# Altium project QUTMS-SHDN-V00.PrjPcb
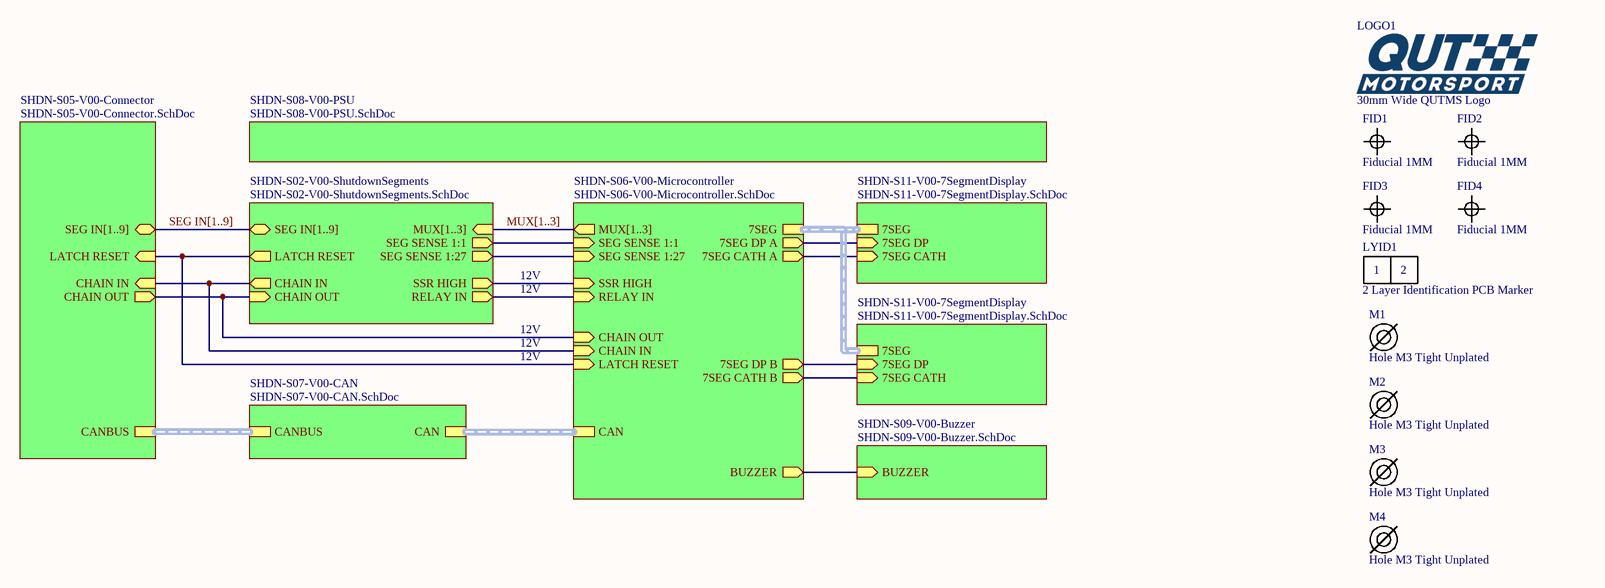
[diagram p0: SHDN-S01-V00-ShutdownBoard.SchDoc]
11 sheets, 173 parts. Net scope: hierarchical (ports join the sheet entries above them; power ports are global).
Board file: SHDN-P01-V00.PcbDoc
Sheets:
  SHDN-S01-V00-ShutdownBoard.SchDoc
    SHDN-S02-V00-ShutdownSegments = SHDN-S02-V00-ShutdownSegments.SchDoc
      SHDN-S04-V00-ShutdownRelay = SHDN-S04-V00-ShutdownRelay.SchDoc
      SHDN-S03-V00-ShutdownSegment = SHDN-S03-V00-ShutdownSegment.SchDoc
      SHDN-S03-V00-ShutdownSegment = SHDN-S03-V00-ShutdownSegment.SchDoc
      SHDN-S03-V00-ShutdownSegment = SHDN-S03-V00-ShutdownSegment.SchDoc
      SHDN-S03-V00-ShutdownSegment = SHDN-S03-V00-ShutdownSegment.SchDoc
      SHDN-S03-V00-ShutdownSegment = SHDN-S03-V00-ShutdownSegment.SchDoc
      SHDN-S03-V00-ShutdownSegment = SHDN-S03-V00-ShutdownSegment.SchDoc
      SHDN-S03-V00-ShutdownSegment = SHDN-S03-V00-ShutdownSegment.SchDoc
      SHDN-S03-V00-ShutdownSegment = SHDN-S03-V00-ShutdownSegment.SchDoc
      SHDN-S10-V00-ShutdownSense = SHDN-S10-V00-ShutdownSense.SchDoc
    SHDN-S06-V00-Microcontroller = SHDN-S06-V00-Microcontroller.SchDoc
    SHDN-S08-V00-PSU = SHDN-S08-V00-PSU.SchDoc
    SHDN-S05-V00-Connector = SHDN-S05-V00-Connector.SchDoc
    SHDN-S07-V00-CAN = SHDN-S07-V00-CAN.SchDoc
    SHDN-S09-V00-Buzzer = SHDN-S09-V00-Buzzer.SchDoc
    SHDN-S11-V00-7SegmentDisplay = SHDN-S11-V00-7SegmentDisplay.SchDoc
    SHDN-S11-V00-7SegmentDisplay = SHDN-S11-V00-7SegmentDisplay.SchDoc

## Sheet SHDN-S01-V00-ShutdownBoard.SchDoc: Shutdown Board 2020
size A3; DrawnBy: Jonn Dillon; DocumentNumber: 1; Revision: 00; SheetNumber: 1; SheetTotal: 11; Project: Shutdown Board 2020; Version: 00

### Parts
FID1  Fiducial 1MM  [FIDUCIAL 1MM]
FID2  Fiducial 1MM  [FIDUCIAL 1MM]
FID3  Fiducial 1MM  [FIDUCIAL 1MM]
FID4  Fiducial 1MM  [FIDUCIAL 1MM]
LOGO1  30mm Wide QUTMS Logo  [QUTMS LOGO 30MM]
LYID1  2 Layer Identification PCB Marker  [LAYER IDENT 2]
M1  Hole M3 Tight Unplated  [M3.2 UNPLATED]
M2  Hole M3 Tight Unplated  [M3.2 UNPLATED]
M3  Hole M3 Tight Unplated  [M3.2 UNPLATED]
M4  Hole M3 Tight Unplated  [M3.2 UNPLATED]

### Sub-sheets
SHDN-S02-V00-ShutdownSegments = SHDN-S02-V00-ShutdownSegments.SchDoc: SEG IN[1..9] (bidir), LATCH RESET (out), CHAIN IN (out), CHAIN OUT (in), MUX[1..3] (in), RELAY IN (out), SSR HIGH (out), SEG SENSE 1:1 (out), SEG SENSE 1:27 (out)
SHDN-S05-V00-Connector = SHDN-S05-V00-Connector.SchDoc: SEG IN[1..9] (bidir), CANBUS (harness CANBUS), CHAIN OUT (out), CHAIN IN (in), LATCH RESET (in)
SHDN-S06-V00-Microcontroller = SHDN-S06-V00-Microcontroller.SchDoc: BUZZER (out), CAN (harness CAN), MUX[1..3] (out), 7SEG (harness 7SEG), 7SEG DP A (out), 7SEG CATH A (out), 7SEG DP B (out), 7SEG CATH B (out), SSR HIGH (in), RELAY IN (in), CHAIN OUT (in), CHAIN IN (in), LATCH RESET (in), SEG SENSE 1:1 (in), SEG SENSE 1:27 (in)
SHDN-S07-V00-CAN = SHDN-S07-V00-CAN.SchDoc: CAN (harness CAN), CANBUS (harness CANBUS)
SHDN-S08-V00-PSU = SHDN-S08-V00-PSU.SchDoc: no entries
SHDN-S09-V00-Buzzer = SHDN-S09-V00-Buzzer.SchDoc: BUZZER (in)
SHDN-S11-V00-7SegmentDisplay = SHDN-S11-V00-7SegmentDisplay.SchDoc: 7SEG (harness 7SEG), 7SEG CATH (in), 7SEG DP (in)
SHDN-S11-V00-7SegmentDisplay = SHDN-S11-V00-7SegmentDisplay.SchDoc: 7SEG (harness 7SEG), 7SEG CATH (in), 7SEG DP (in)

### Nets
7SEG CATH A: sheet SHDN-S06-V00-Microcontroller/7SEG CATH B, sheet SHDN-S11-V00-7SegmentDisplay/7SEG CATH
7SEG CATH B: sheet SHDN-S06-V00-Microcontroller/7SEG CATH A, sheet SHDN-S11-V00-7SegmentDisplay/7SEG CATH
7SEG DP A: sheet SHDN-S06-V00-Microcontroller/7SEG DP A, sheet SHDN-S11-V00-7SegmentDisplay/7SEG DP
7SEG DP B: sheet SHDN-S06-V00-Microcontroller/7SEG DP B, sheet SHDN-S11-V00-7SegmentDisplay/7SEG DP
BUZZER: sheet SHDN-S06-V00-Microcontroller/BUZZER, sheet SHDN-S09-V00-Buzzer/BUZZER
CHAIN IN: sheet SHDN-S02-V00-ShutdownSegments/CHAIN IN, sheet SHDN-S06-V00-Microcontroller/CHAIN IN, sheet SHDN-S05-V00-Connector/CHAIN IN
CHAIN OUT: sheet SHDN-S02-V00-ShutdownSegments/CHAIN OUT, sheet SHDN-S06-V00-Microcontroller/CHAIN OUT, sheet SHDN-S05-V00-Connector/CHAIN OUT
LATCH RESET: sheet SHDN-S02-V00-ShutdownSegments/LATCH RESET, sheet SHDN-S06-V00-Microcontroller/LATCH RESET, sheet SHDN-S05-V00-Connector/LATCH RESET
RELAY IN: sheet SHDN-S02-V00-ShutdownSegments/RELAY IN, sheet SHDN-S06-V00-Microcontroller/RELAY IN
SEG SENSE 1:1: sheet SHDN-S02-V00-ShutdownSegments/SEG SENSE 1:1, sheet SHDN-S06-V00-Microcontroller/SEG SENSE 1:1
SEG SENSE 1:27: sheet SHDN-S02-V00-ShutdownSegments/SEG SENSE 1:27, sheet SHDN-S06-V00-Microcontroller/SEG SENSE 1:27
SSR HIGH: sheet SHDN-S02-V00-ShutdownSegments/SSR HIGH, sheet SHDN-S06-V00-Microcontroller/SSR HIGH

### Buses and harness runs
bus MUX[1..3] = sheet SHDN-S02-V00-ShutdownSegments/MUX[1..3] = sheet SHDN-S06-V00-Microcontroller/MUX[1..3]
bus SEG IN[1..9] = sheet SHDN-S02-V00-ShutdownSegments/SEG IN[1..9] = sheet SHDN-S05-V00-Connector/SEG IN[1..9]
harness sheet SHDN-S05-V00-Connector/CANBUS = sheet SHDN-S07-V00-CAN/CANBUS
harness sheet SHDN-S06-V00-Microcontroller/7SEG = sheet SHDN-S11-V00-7SegmentDisplay/7SEG
harness sheet SHDN-S06-V00-Microcontroller/CAN = sheet SHDN-S07-V00-CAN/CAN

### Notes on the sheet
- 12V
- Revision History:
- Sheet Title:
- Rev
- Date
- Description
- Project:
- Size:
- Drawn By:
- A3
- Number:
- Revision:
- Sheet
- Version:
- of
- QUT Motorsport
- O-120, Gardens Point
- 2 George Street
- Brisbane, QLD 4000
- Australia
- Print Date:
- Print Time:
- File Name:
- (in symbol Layer Identification 2) 1; 2

### Library data of the parts
LOGO1 = QUTMS Logo 30mm
LYID1 = Layer Identification 2
M1-M4 = Hole M3 Tight Unplated: M3.2 Hole, No Plating

## Sheet SHDN-S02-V00-ShutdownSegments.SchDoc: Shutdown Segments
size A3; DrawnBy: Jonn Dillon; DocumentNumber: 2; SheetNumber: 2; SheetTotal: 11; Project: Shutdown Board 2020
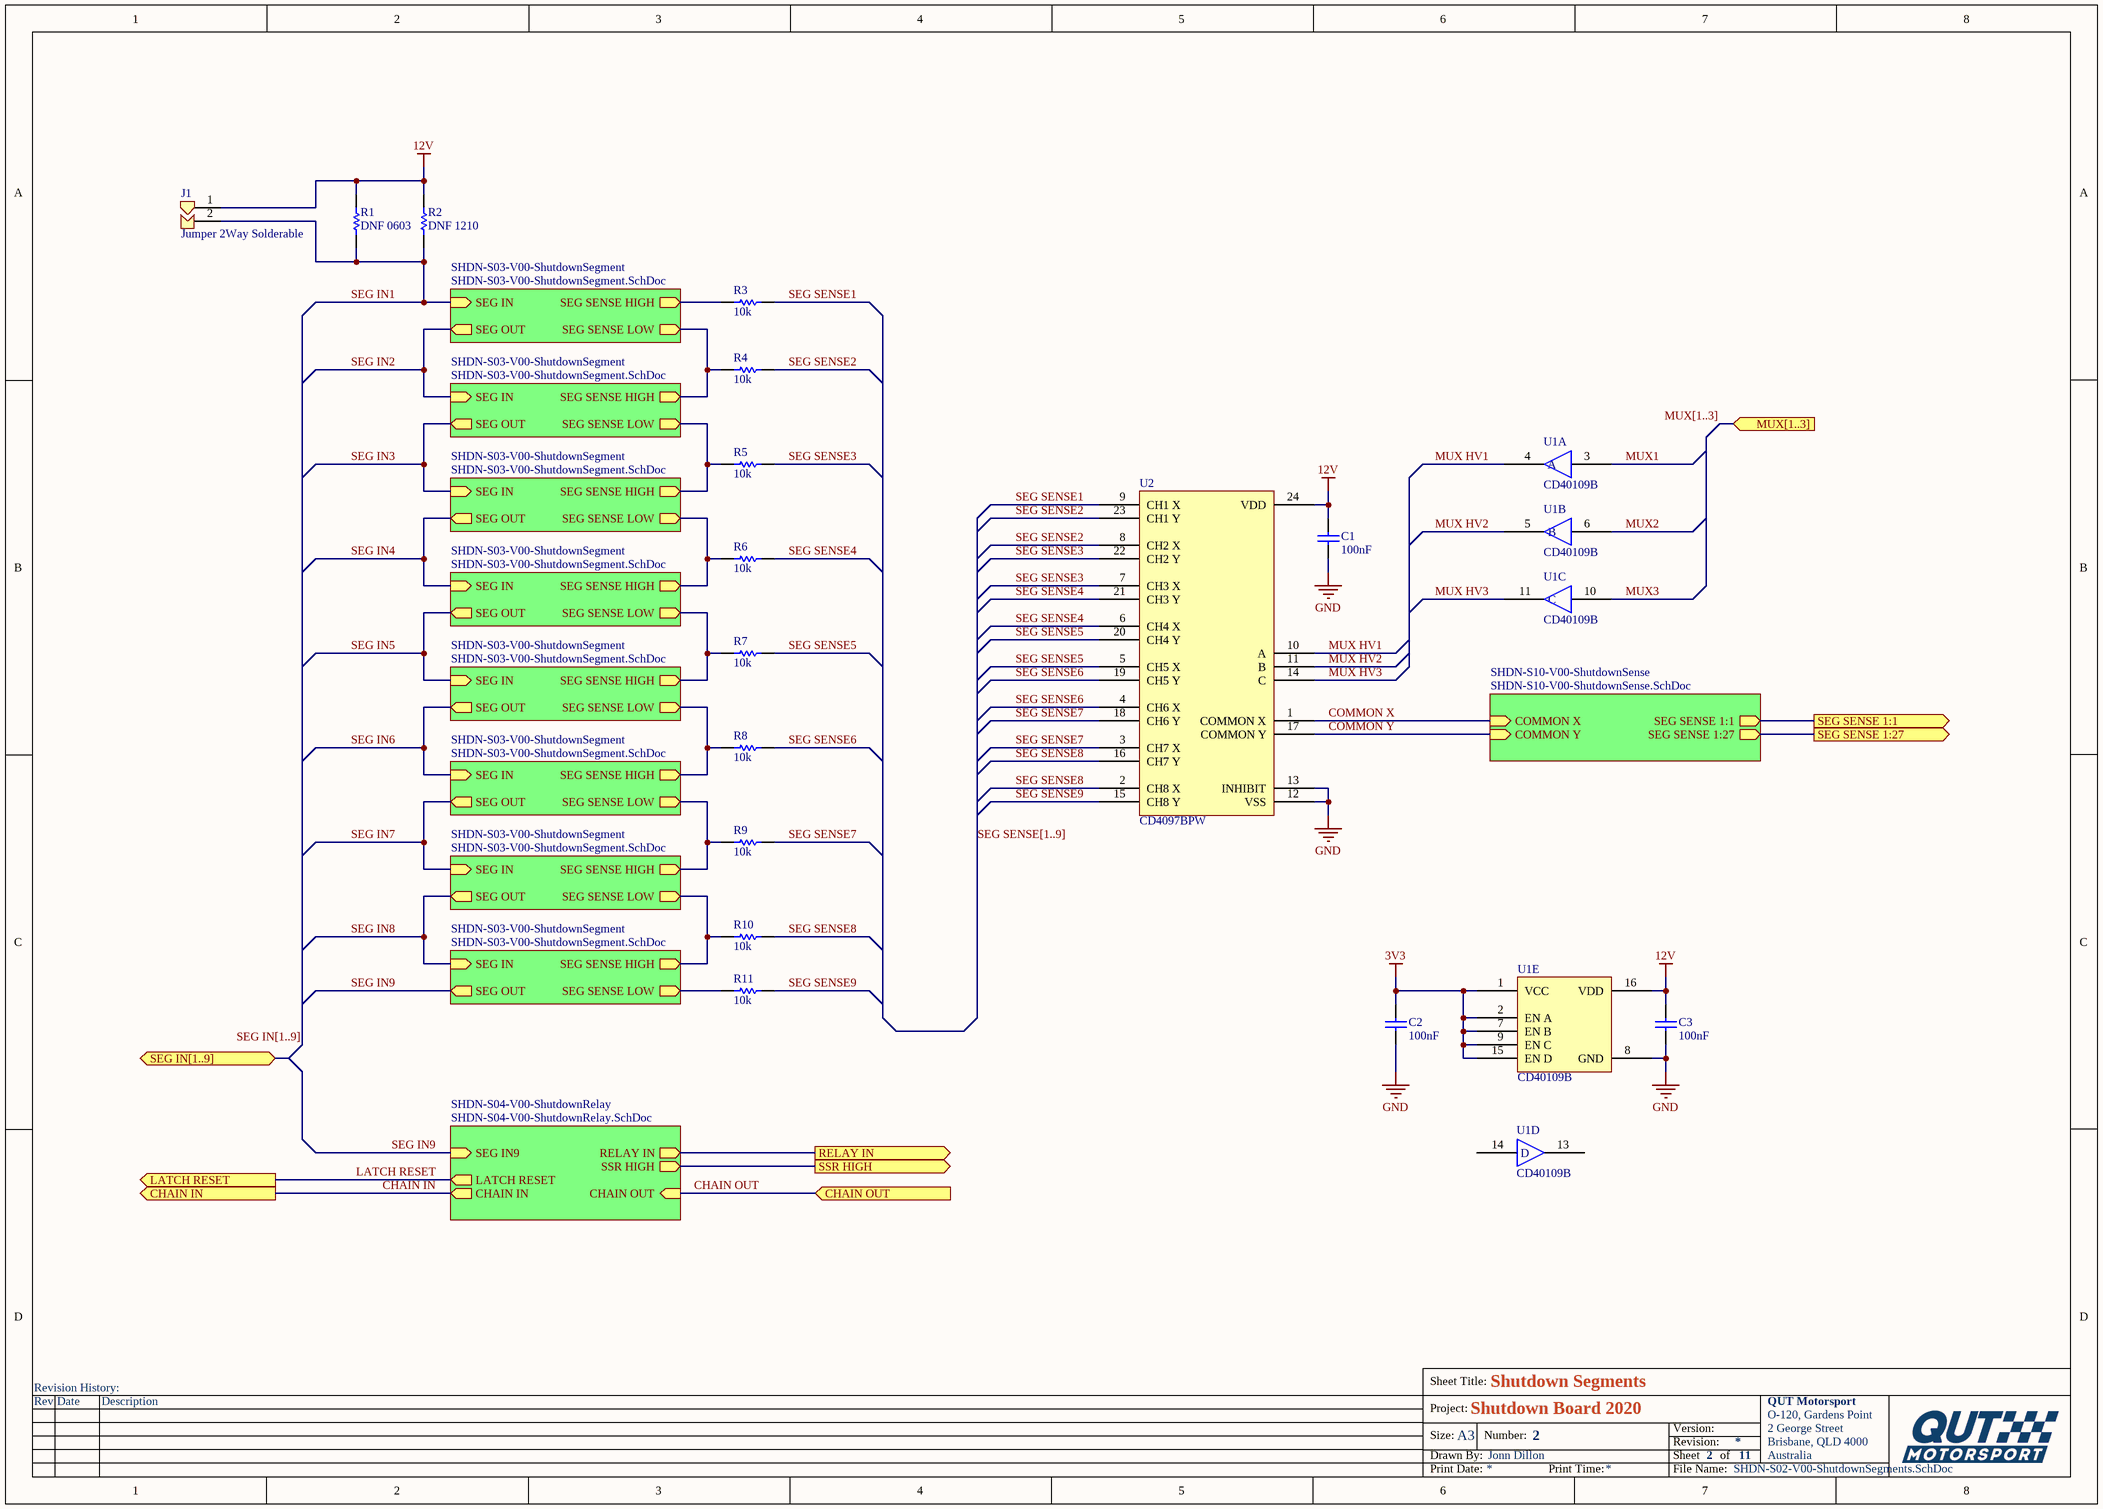
[diagram p1: SHDN-S02-V00-ShutdownSegments.SchDoc]

### Parts
C1  100nF  [Cap_Ceramic_0603]
C2  100nF  [Cap_Ceramic_0603]
C3  100nF  [Cap_Ceramic_0603]
J1  Jumper 2Way Solderable  [Jumper_2Way_Solderable]
R1  DNF 0603  [Res_ThinFilm_0603]
R2  DNF 1210  [Res_ThinFilm_1210]
R3  10k  [Res_ThinFilm_0603]
R4  10k  [Res_ThinFilm_0603]
R5  10k  [Res_ThinFilm_0603]
R6  10k  [Res_ThinFilm_0603]
R7  10k  [Res_ThinFilm_0603]
R8  10k  [Res_ThinFilm_0603]
R9  10k  [Res_ThinFilm_0603]
R10  10k  [Res_ThinFilm_0603]
R11  10k  [Res_ThinFilm_0603]
U1  CD40109B  [TSSOP-16]  (parts A,B,C,D,E of 5)
U2  CD4097BPW  [TSSOP-24]

### Sub-sheets
SHDN-S03-V00-ShutdownSegment = SHDN-S03-V00-ShutdownSegment.SchDoc: SEG OUT (out), SEG IN (in), SEG SENSE HIGH (out), SEG SENSE LOW (out)
SHDN-S03-V00-ShutdownSegment = SHDN-S03-V00-ShutdownSegment.SchDoc: SEG OUT (out), SEG IN (in), SEG SENSE HIGH (out), SEG SENSE LOW (out)
SHDN-S03-V00-ShutdownSegment = SHDN-S03-V00-ShutdownSegment.SchDoc: SEG OUT (out), SEG IN (in), SEG SENSE HIGH (out), SEG SENSE LOW (out)
SHDN-S03-V00-ShutdownSegment = SHDN-S03-V00-ShutdownSegment.SchDoc: SEG OUT (out), SEG IN (in), SEG SENSE HIGH (out), SEG SENSE LOW (out)
SHDN-S03-V00-ShutdownSegment = SHDN-S03-V00-ShutdownSegment.SchDoc: SEG OUT (out), SEG IN (in), SEG SENSE HIGH (out), SEG SENSE LOW (out)
SHDN-S03-V00-ShutdownSegment = SHDN-S03-V00-ShutdownSegment.SchDoc: SEG OUT (out), SEG IN (in), SEG SENSE HIGH (out), SEG SENSE LOW (out)
SHDN-S03-V00-ShutdownSegment = SHDN-S03-V00-ShutdownSegment.SchDoc: SEG OUT (out), SEG IN (in), SEG SENSE HIGH (out), SEG SENSE LOW (out)
SHDN-S03-V00-ShutdownSegment = SHDN-S03-V00-ShutdownSegment.SchDoc: SEG OUT (out), SEG IN (in), SEG SENSE HIGH (out), SEG SENSE LOW (out)
SHDN-S04-V00-ShutdownRelay = SHDN-S04-V00-ShutdownRelay.SchDoc: CHAIN OUT (in), CHAIN IN (out), LATCH RESET (out), SEG IN9 (in), RELAY IN (out), SSR HIGH (out)
SHDN-S10-V00-ShutdownSense = SHDN-S10-V00-ShutdownSense.SchDoc: COMMON X (in), COMMON Y (in), SEG SENSE 1:27 (out), SEG SENSE 1:1 (out)

### Ports
CHAIN IN (out), CHAIN OUT (in), LATCH RESET (out), MUX[1..3] (in), RELAY IN (out), SEG IN[1..9] (bidir), SEG SENSE 1:1 (out), SEG SENSE 1:27 (out), SSR HIGH (out)

### Nets
3V3: C2.2 U1.1(VCC) U1.2(EN_A) U1.7(EN_B) U1.9(EN_C) U1.15(EN_D)
12V: C1.2 C3.2 J1.1 R1.2 R2.2 U1.16(VDD) U2.24(VDD)
GND: C1.1 C2.1 C3.1 U1.8(GND) U2.12(VSS) U2.13(INHIBIT)
CHAIN IN: port CHAIN IN, sheet SHDN-S04-V00-ShutdownRelay/CHAIN IN
CHAIN OUT: port CHAIN OUT, sheet SHDN-S04-V00-ShutdownRelay/CHAIN OUT
COMMON X: U2.1(COMMON_X) ; sheet SHDN-S10-V00-ShutdownSense/COMMON X
COMMON Y: U2.17(COMMON_Y) ; sheet SHDN-S10-V00-ShutdownSense/COMMON Y
LATCH RESET: port LATCH RESET, sheet SHDN-S04-V00-ShutdownRelay/LATCH RESET
MUX1: U1.3(A)
MUX2: U1.6(B)
MUX3: U1.10(C)
MUX HV1: U1.4(E) U2.10(A)
MUX HV2: U1.5(F) U2.11(B)
MUX HV3: U1.11(G) U2.14(C)
RELAY IN: port RELAY IN, sheet SHDN-S04-V00-ShutdownRelay/RELAY IN
SEG IN1: J1.2 R1.1 R2.1 R3.1 ; sheet SHDN-S03-V00-ShutdownSegment/SEG IN, sheet SHDN-S03-V00-ShutdownSegment/SEG SENSE HIGH
SEG IN2: R4.1 ; sheet SHDN-S03-V00-ShutdownSegment/SEG OUT, sheet SHDN-S03-V00-ShutdownSegment/SEG SENSE LOW, sheet SHDN-S03-V00-ShutdownSegment/SEG IN, sheet SHDN-S03-V00-ShutdownSegment/SEG SENSE HIGH
SEG IN3: R5.1 ; sheet SHDN-S03-V00-ShutdownSegment/SEG OUT, sheet SHDN-S03-V00-ShutdownSegment/SEG SENSE LOW, sheet SHDN-S03-V00-ShutdownSegment/SEG IN, sheet SHDN-S03-V00-ShutdownSegment/SEG SENSE HIGH
SEG IN4: R6.1 ; sheet SHDN-S03-V00-ShutdownSegment/SEG OUT, sheet SHDN-S03-V00-ShutdownSegment/SEG SENSE LOW, sheet SHDN-S03-V00-ShutdownSegment/SEG IN, sheet SHDN-S03-V00-ShutdownSegment/SEG SENSE HIGH
SEG IN5: R7.1 ; sheet SHDN-S03-V00-ShutdownSegment/SEG OUT, sheet SHDN-S03-V00-ShutdownSegment/SEG SENSE LOW, sheet SHDN-S03-V00-ShutdownSegment/SEG IN, sheet SHDN-S03-V00-ShutdownSegment/SEG SENSE HIGH
SEG IN6: R8.1 ; sheet SHDN-S03-V00-ShutdownSegment/SEG OUT, sheet SHDN-S03-V00-ShutdownSegment/SEG SENSE LOW, sheet SHDN-S03-V00-ShutdownSegment/SEG IN, sheet SHDN-S03-V00-ShutdownSegment/SEG SENSE HIGH
SEG IN7: R9.1 ; sheet SHDN-S03-V00-ShutdownSegment/SEG OUT, sheet SHDN-S03-V00-ShutdownSegment/SEG SENSE LOW, sheet SHDN-S03-V00-ShutdownSegment/SEG IN, sheet SHDN-S03-V00-ShutdownSegment/SEG SENSE HIGH
SEG IN8: R10.1 ; sheet SHDN-S03-V00-ShutdownSegment/SEG OUT, sheet SHDN-S03-V00-ShutdownSegment/SEG SENSE LOW, sheet SHDN-S03-V00-ShutdownSegment/SEG IN, sheet SHDN-S03-V00-ShutdownSegment/SEG SENSE HIGH
SEG IN9: R11.1 ; sheet SHDN-S04-V00-ShutdownRelay/SEG IN9, sheet SHDN-S03-V00-ShutdownSegment/SEG OUT, sheet SHDN-S03-V00-ShutdownSegment/SEG SENSE LOW
SEG SENSE1: R3.2 U2.9(CH1_X)
SEG SENSE2: R4.2 U2.8(CH2_X) U2.23(CH1_Y)
SEG SENSE3: R5.2 U2.7(CH3_X) U2.22(CH2_Y)
SEG SENSE4: R6.2 U2.6(CH4_X) U2.21(CH3_Y)
SEG SENSE5: R7.2 U2.5(CH5_X) U2.20(CH4_Y)
SEG SENSE6: R8.2 U2.4(CH6_X) U2.19(CH5_Y)
SEG SENSE7: R9.2 U2.3(CH7_X) U2.18(CH6_Y)
SEG SENSE8: R10.2 U2.2(CH8_X) U2.16(CH7_Y)
SEG SENSE9: R11.2 U2.15(CH8_Y)
SEG SENSE 1:1: port SEG SENSE 1:1, sheet SHDN-S10-V00-ShutdownSense/SEG SENSE 1:1
SEG SENSE 1:27: port SEG SENSE 1:27, sheet SHDN-S10-V00-ShutdownSense/SEG SENSE 1:27
SSR HIGH: port SSR HIGH, sheet SHDN-S04-V00-ShutdownRelay/SSR HIGH

Not connected (* = marked no-connect by the designer): U1 13(H) 14(D)

### Buses and harness runs
bus MUX[1..3] = port MUX[1..3]
bus SEG IN[1..9] = port SEG IN[1..9]
bus SEG SENSE[1..9]

### Notes on the sheet
- Revision History:
- Sheet Title:
- Rev
- Date
- Description
- Project:
- Size:
- Drawn By:
- A3
- Number:
- Revision:
- Sheet
- Version:
- of
- QUT Motorsport
- O-120, Gardens Point
- 2 George Street
- Brisbane, QLD 4000
- Australia
- Print Date:
- Print Time:
- File Name:

### Library data of the parts
C1-C3 = 100nF 50V 5% X7R 0603: Capacitor, Ceramic, SMD, 100nF, 50V, 5%, X7R, 0603
J1 = Jumper 2Way Side Solderable
R1 = DNF 0603: Resistor, SMD, DNF, 0.1W, 0603
R2 = DNF 1210: Resistor, SMD, DNF, 0.1W, 1210
R3-R11 = 10k 5% 0603: Resistor, SMD, 10k, 0.1W, 5%, 0603
U1 = CD40109B: Voltage Level Translator Unidirectional 4 Circuit 1 Channel 16-TSSOP
U2 = CD4097BPW: 2 Circuit IC Switch 8:1 240Ohm, TSSOP-24

## Sheet SHDN-S04-V00-ShutdownRelay.SchDoc: Shutdown Loop Termination & Latching Relay
size A3; DrawnBy: Jonn Dillon; DocumentNumber: 9; SheetNumber: 9; SheetTotal: 11; Project: Shutdown Board 2020
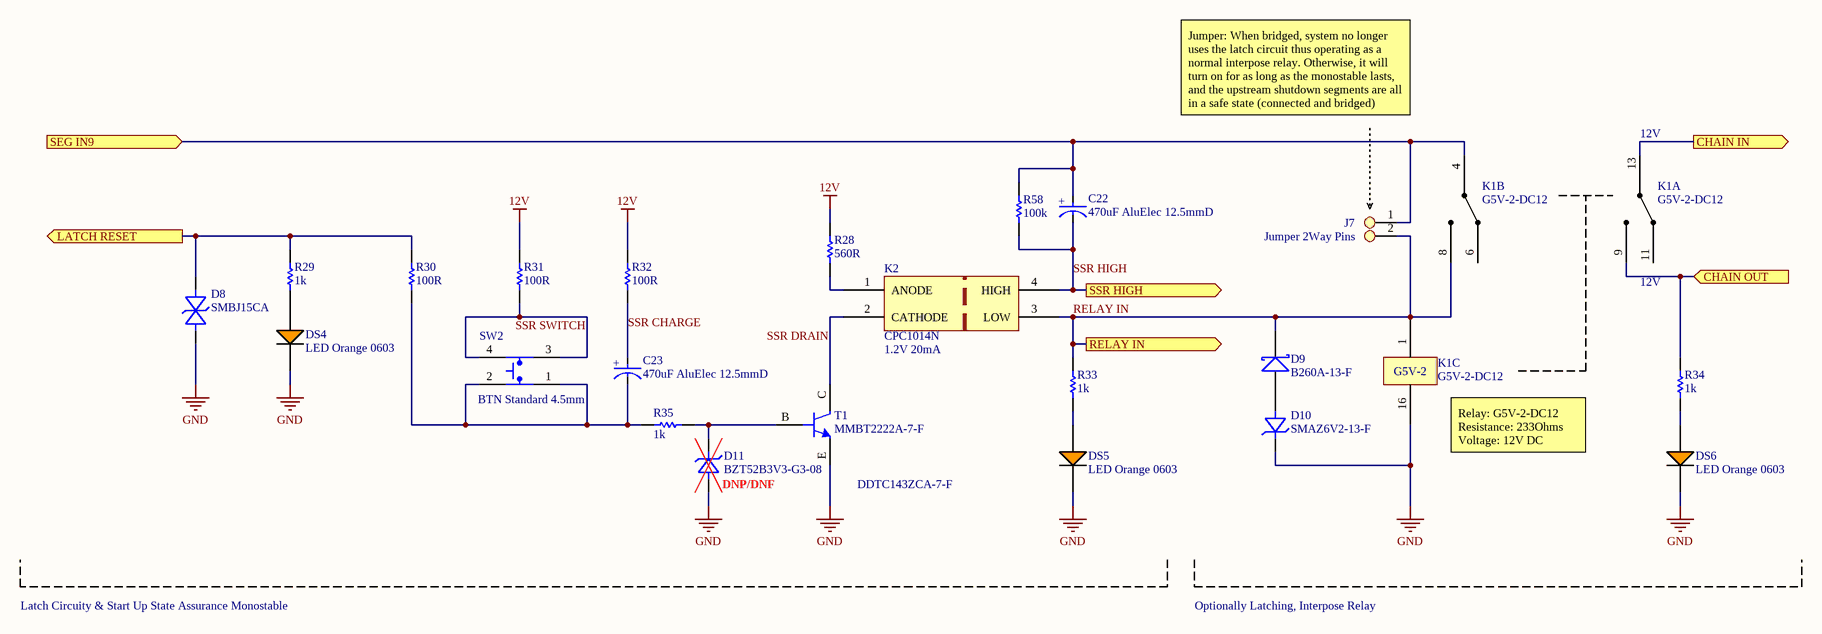
[diagram p2: SHDN-S04-V00-ShutdownRelay.SchDoc]

### Parts
C22  470uF AluElec 12.5mmD  [CAL_ALU_12.5mmD_20mmL]
C23  470uF AluElec 12.5mmD  [CAL_ALU_12.5mmD_20mmL]
D8  SMBJ15CA  [SMB]
D9  B260A-13-F  [SMA]
D10  SMAZ6V2-13-F  [SMA]
D11  BZT52B3V3-G3-08  [SOD123]
DS4  LED Orange 0603  [LED ORANGE 0603]
DS5  LED Orange 0603  [LED ORANGE 0603]
DS6  LED Orange 0603  [LED ORANGE 0603]
J7  Jumper 2Way Pins  [Jumper_2Way_Pin]
K1  G5V-2-DC12  [G5V-2]  (parts A,B,C of 3)
K2  CPC1014N  [CPC1014N]
R28  560R  [Res_ThinFilm_0603]
R29  1k  [Res_ThinFilm_0603]
R30  100R  [Res_ThinFilm_0603]
R31  100R  [Res_ThinFilm_0603]
R32  100R  [Res_ThinFilm_0603]
R33  1k  [Res_ThinFilm_0603]
R34  1k  [Res_ThinFilm_0603]
R35  1k  [Res_ThinFilm_0603]
R58  100k  [Res_ThinFilm_0603]
SW2  BTN Standard 4.5mm  [BTN STANDARD 4.5mm X 4.5mm]
T1  MMBT2222A-7-F  [SOT23-3 - Transistor]

### Ports
CHAIN IN (out), CHAIN OUT (in), LATCH RESET (out), RELAY IN (out), SEG IN9 (in), SSR HIGH (out)

### Nets
12V: R28.1 R31.2 R32.2
GND: D8.A(Anode) D10.K(Cathode) D11.A(Anode) DS4.2(C) DS5.2(C) DS6.2(C) K1.16 T1.E
CHAIN IN: K1.13 ; port CHAIN IN
CHAIN OUT: K1.9 R34.2 ; port CHAIN OUT
LATCH RESET: D8.K(Cathode) R29.2 R30.2 ; port LATCH RESET
RELAY IN: D9.K J7.2 K1.1 K1.8 K2.3(LOW) R33.2 ; port RELAY IN
SEG IN9: C22.A J7.1 K1.4 R58.2 ; port SEG IN9
SSR CHARGE: C23.A R32.1
SSR DRAIN: K2.2(CATHODE) T1.C
SSR HIGH: C22.K K2.4(HIGH) R58.1 ; port SSR HIGH
SSR SWITCH: R31.1 SW2.3 SW2.4
NetC23_K: C23.K R30.1 R35.1 SW2.1 SW2.2
NetD9_A: D9.A D10.A(Anode)
NetD11_K: D11.K(Cathode) R35.2 T1.B
NetDS4_1: DS4.1(A) R29.1
NetDS5_1: DS5.1(A) R33.1
NetDS6_1: DS6.1(A) R34.1
NetK2_1: K2.1(ANODE) R28.2

Not connected (* = marked no-connect by the designer): K1 6 11

### Notes on the sheet
- Jumper: When bridged, system no longer uses the latch circuit thus operating as a normal interpose relay. Otherwise, it will turn on for as long as the monostable lasts, and the upstream shutdown segments are all in a safe state (connected and bridged)
- (near K1) 12V
- (near K2) 1.2V 20mA
- (near D11) DNP/DNF
- (near T1) DDTC143ZCA-7-F
- (near K1) Relay: G5V-2-DC12
  Resistance: 233Ohms
  Voltage: 12V DC
- Latch Circuity & Start Up State Assurance Monostable
- Optionally Latching, Interpose Relay
- Revision History:
- Sheet Title:
- Rev
- Date
- Description
- Project:
- Size:
- Drawn By:
- A3
- Number:
- Revision:
- Sheet
- Version:
- of
- QUT Motorsport
- O-120, Gardens Point
- 2 George Street
- Brisbane, QLD 4000
- Australia
- Print Date:
- Print Time:
- File Name:
- (in symbol 470uF 50V 20% AluElec 12.5mmD) +
- (in symbol G5V-2-DC12, part C) G5V-2

### Library data of the parts
C22 C23 = 470uF 50V 20% AluElec 12.5mmD: Capacitor, AluElec, SMD, 470F, 50V, 20%, AluElec, 12.5mmD
D8 = SMBJ15CA: Diode, SMD, TVS Diode, 15V 24.4V, DO214AA/SMB; ComponentLink1Description: Digikey; ComponentLink1URL: https://www.digikey.com.au/product-detail/en/littelfuse-inc/SMBJ15CA/SMBJ15CALFCT-ND/285983; ComponentLink2Description: Datasheet; ComponentLink2URL: https://www.littelfuse.com/~/media/electronics/datasheets/tvs_diodes/littelfuse_tvs_diode_smbj_datasheet.pdf.pdf
D9 = B260A-13-F: Diode, Schottky Barrier Rectifier, 60 V, 2 A, B260A-13-F
D10 = SMAZ6V2-13-F: Zener Diode 6.2V 1W ±5% Surface Mount SMA; Manufacturer: Generic; MPN: 5V6 500mW SMA
D11 = BZT52B3V3-G3-08: Diode, SMD, Zenner, 3.3V, 2%, 410mW, SOD-123; ComponentLink1Description: Digikey; ComponentLink1URL: https://www.digikey.com.au/product-detail/en/vishay-semiconductor-diodes-division/BZT52B3V3-G3-08/BZT52B3V3-G3-08GICT-ND/8284035; ComponentLink2Description: Datasheet; ComponentLink2URL: https://www.vishay.com/docs/83340/bzt52g.pdf
J7 = Jumper 2Way Side Pins
K1 = G5V-2-DC12: General Purpose Relay DPDT (2 Form C) Through Hole, 12V, 2A
K2 = CPC1014N: Solid State SPST-NO (1 Form A) 4-SOP (0.150", 3.81mm)
R28 = 560R 5% 0603: Resistor, SMD, 560R, 0.1W, 5%, 0603
R29 R33-R35 = 1k 5% 0603: Resistor, SMD, 1k, 0.1W, 5%, 0603
R30-R32 = 100R 5%, 0603: Resistor, SMD, 100R, 0.1W, 5%, 0603
R58 = 100k 5%, 0603: Resistor, SMD, 100k, 0.1W, 5%, 0603
SW2 = BTN Standard 4.5mm: Standard 4.5mm X 4.5mm momentary button; ComponentLink1Description: LCSC; ComponentLink1URL: https://lcsc.com/product-detail/Tactile-Switches_BRIGHT-TSA063G50-250_C294565.html
T1 = MMBT2222A-7-F: Bipolar (BJT) Transistor NPN 40V 600mA 300MHz 310mW Surface Mount SOT-23-3; ComponentLink1Description: Digikey; ComponentLink1URL: https://www.digikey.com.au/product-detail/en/diodes-incorporated/DDTC143ZCA-7-F/DDTC143ZCA-FDICT-ND/815626; ComponentLink2Description: Datasheet; ComponentLink2URL: https://www.diodes.com/assets/Datasheets/ds30330.pdf

## Sheet SHDN-S03-V00-ShutdownSegment.SchDoc: Shutdown Segment
size A3; DrawnBy: Jonn Dillon; DocumentNumber: 3; SheetNumber: 3; SheetTotal: 11
Used 8 times, as channels SHDN-S02-V00-ShutdownSegments/SHDN-S03-V00-ShutdownSegment, SHDN-S02-V00-ShutdownSegments/SHDN-S03-V00-ShutdownSegment, SHDN-S02-V00-ShutdownSegments/SHDN-S03-V00-ShutdownSegment, SHDN-S02-V00-ShutdownSegments/SHDN-S03-V00-ShutdownSegment, SHDN-S02-V00-ShutdownSegments/SHDN-S03-V00-ShutdownSegment, SHDN-S02-V00-ShutdownSegments/SHDN-S03-V00-ShutdownSegment, SHDN-S02-V00-ShutdownSegments/SHDN-S03-V00-ShutdownSegment, SHDN-S02-V00-ShutdownSegments/SHDN-S03-V00-ShutdownSegment. Parts and nets are listed once, with the designators drawn on the sheet.
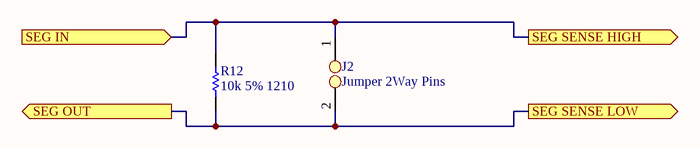
[diagram p3: SHDN-S03-V00-ShutdownSegment.SchDoc]

### Parts
J2  Jumper 2Way Pins  [Jumper_2Way_Pin]
R12  10k 5% 1210  [Res_ThinFilm_1210]

### Ports
SEG IN (in), SEG OUT (out), SEG SENSE HIGH (out), SEG SENSE LOW (out)

### Nets
SEG IN: J2.1 R12.2 ; port SEG IN, port SEG SENSE HIGH
SEG OUT: J2.2 R12.1 ; port SEG OUT, port SEG SENSE LOW

### Channels
SHDN-S02-V00-ShutdownSegments/SHDN-S03-V00-ShutdownSegment: designators end in A; ports SEG IN=SEG IN1 SEG OUT=SEG IN2 SEG SENSE HIGH=SEG IN1 SEG SENSE LOW=SEG IN2
SHDN-S02-V00-ShutdownSegments/SHDN-S03-V00-ShutdownSegment: designators end in B; ports SEG IN=SEG IN2 SEG OUT=SEG IN3 SEG SENSE HIGH=SEG IN2 SEG SENSE LOW=SEG IN3
SHDN-S02-V00-ShutdownSegments/SHDN-S03-V00-ShutdownSegment: designators end in C; ports SEG IN=SEG IN3 SEG OUT=SEG IN4 SEG SENSE HIGH=SEG IN3 SEG SENSE LOW=SEG IN4
SHDN-S02-V00-ShutdownSegments/SHDN-S03-V00-ShutdownSegment: designators end in D; ports SEG IN=SEG IN4 SEG OUT=SEG IN5 SEG SENSE HIGH=SEG IN4 SEG SENSE LOW=SEG IN5
SHDN-S02-V00-ShutdownSegments/SHDN-S03-V00-ShutdownSegment: designators end in E; ports SEG IN=SEG IN5 SEG OUT=SEG IN6 SEG SENSE HIGH=SEG IN5 SEG SENSE LOW=SEG IN6
SHDN-S02-V00-ShutdownSegments/SHDN-S03-V00-ShutdownSegment: designators end in F; ports SEG IN=SEG IN6 SEG OUT=SEG IN7 SEG SENSE HIGH=SEG IN6 SEG SENSE LOW=SEG IN7
SHDN-S02-V00-ShutdownSegments/SHDN-S03-V00-ShutdownSegment: designators end in G; ports SEG IN=SEG IN7 SEG OUT=SEG IN8 SEG SENSE HIGH=SEG IN7 SEG SENSE LOW=SEG IN8
SHDN-S02-V00-ShutdownSegments/SHDN-S03-V00-ShutdownSegment: designators end in H; ports SEG IN=SEG IN8 SEG OUT=SEG IN9 SEG SENSE HIGH=SEG IN8 SEG SENSE LOW=SEG IN9

### Notes on the sheet
- Revision History:
- Sheet Title:
- Rev
- Date
- Description
- Project:
- Size:
- Drawn By:
- A3
- Number:
- Revision:
- Sheet
- Version:
- of
- QUT Motorsport
- O-120, Gardens Point
- 2 George Street
- Brisbane, QLD 4000
- Australia
- Print Date:
- Print Time:
- File Name:

### Library data of the parts
J2 = Jumper 2Way Vert Pins
R12 = 10k 5% 1210: Resistor, SMD, 10k, 1W, 5%, 1210

## Sheet SHDN-S10-V00-ShutdownSense.SchDoc: Shutdown Loop Sensing & Amplification
size A3; DrawnBy: Jonn Dillon; DocumentNumber: 10; SheetNumber: 10; SheetTotal: 11; Project: Shutdown Board 2020
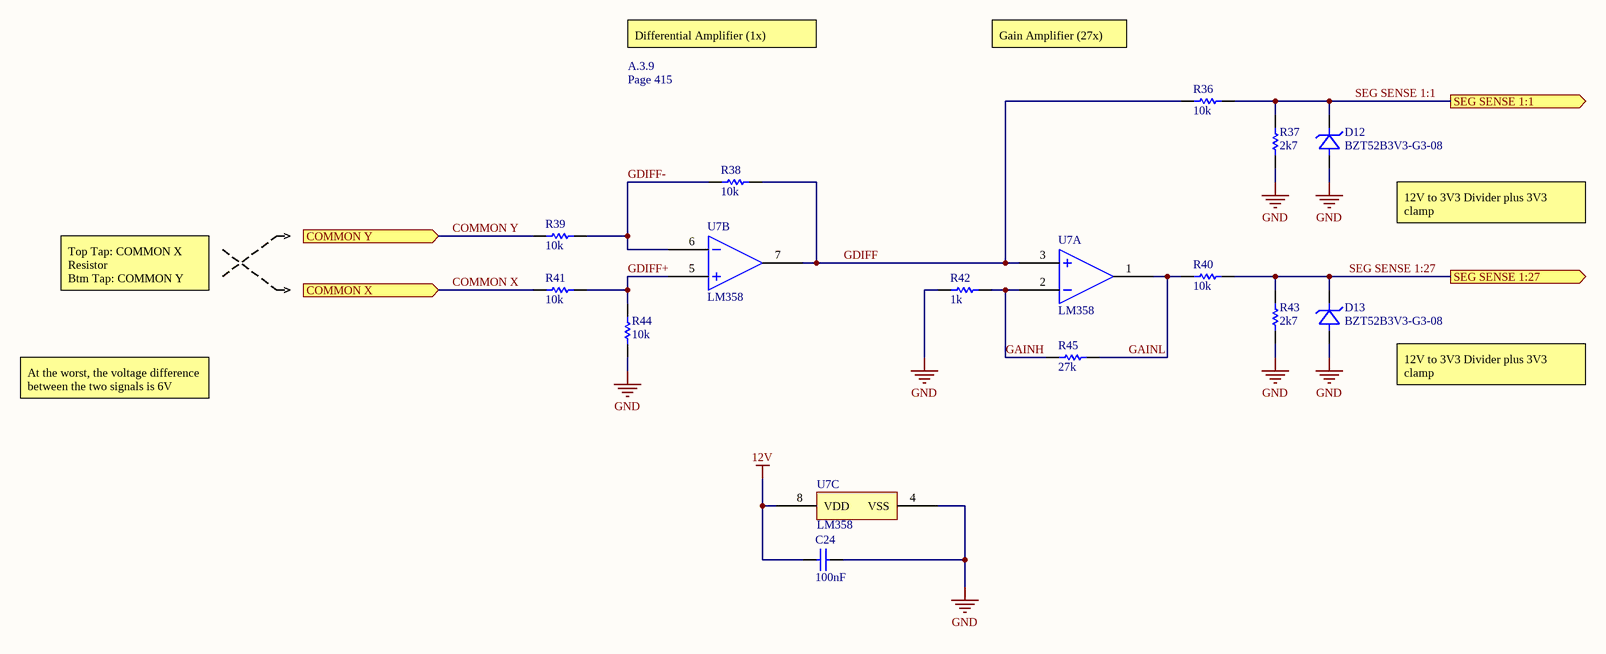
[diagram p4: SHDN-S10-V00-ShutdownSense.SchDoc]

### Parts
C24  100nF  [Cap_Ceramic_0603]
D12  BZT52B3V3-G3-08  [SOD123]
D13  BZT52B3V3-G3-08  [SOD123]
R36  10k  [Res_ThinFilm_0603]
R37  2k7  [Res_ThinFilm_0603]
R38  10k  [Res_ThinFilm_0603]
R39  10k  [Res_ThinFilm_0603]
R40  10k  [Res_ThinFilm_0603]
R41  10k  [Res_ThinFilm_0603]
R42  1k  [Res_ThinFilm_0603]
R43  2k7  [Res_ThinFilm_0603]
R44  10k  [Res_ThinFilm_0603]
R45  27k  [Res_ThinFilm_0603]
U7  LM358  [TSSOP-8]  (parts A,B,C of 3)

### Ports
COMMON X (in), COMMON Y (in), SEG SENSE 1:1 (out), SEG SENSE 1:27 (out)

### Nets
12V: C24.1 U7.8(VDD)
GND: C24.2 D12.A(Anode) D13.A(Anode) R37.1 R42.1 R43.1 R44.1 U7.4(VSS)
COMMON X: R41.1 ; port COMMON X
COMMON Y: R39.1 ; port COMMON Y
GAINH: R42.2 R45.1 U7.2(IN1-)
GAINL: R40.1 R45.2 U7.1(OUT1)
GDIFF: R36.1 R38.2 U7.3(IN1+) U7.7(OUT1)
GDIFF+: R41.2 R44.2 U7.5(IN2+)
GDIFF-: R38.1 R39.2 U7.6(IN2-)
SEG SENSE 1:1: D12.K(Cathode) R36.2 R37.2 ; port SEG SENSE 1:1
SEG SENSE 1:27: D13.K(Cathode) R40.2 R43.2 ; port SEG SENSE 1:27

### Notes on the sheet
- Differential Amplifier (1x)
- Gain Amplifier (27x)
- A.3.9
- Page 415
- 12V to 3V3 Divider plus 3V3 clamp
- Top Tap: COMMON X
  Resistor
  Btm Tap: COMMON Y
- At the worst, the voltage difference between the two signals is 6V
- Revision History:
- Sheet Title:
- Rev
- Date
- Description
- Project:
- Size:
- Drawn By:
- A3
- Number:
- Revision:
- Sheet
- Version:
- of
- QUT Motorsport
- O-120, Gardens Point
- 2 George Street
- Brisbane, QLD 4000
- Australia
- Print Date:
- Print Time:
- File Name:

### Library data of the parts
C24 = 100nF 50V 5% X7R 0603: as C1 on sheet SHDN-S02-V00-ShutdownSegments
D12 D13 = BZT52B3V3-G3-08: as D11 on sheet SHDN-S04-V00-ShutdownRelay; ComponentLink1Description: Digikey; ComponentLink1URL: https://www.digikey.com.au/product-detail/en/vishay-semiconductor-diodes-division/BZT52B3V3-G3-08/BZT52B3V3-G3-08GICT-ND/8284035; ComponentLink2Description: Datasheet; ComponentLink2URL: https://www.vishay.com/docs/83340/bzt52g.pdf
R36 R38-R41 R44 = 10k 5% 0603: Resistor, SMD, 10k, 0.1W, 5%, 0603
R37 R43 = 2k7 5% 0603: Resistor, SMD, 2k7, 0.1W, 5%, 0603
R42 = 1k 5% 0603: Resistor, SMD, 1k, 0.1W, 5%, 0603
R45 = 27k 5% 0603: Resistor, SMD, 27k, 0.1W, 5%, 0603
U7 = LM358: General Purpose Amplifier 2 Circuit 8-SOIC

## Sheet SHDN-S06-V00-Microcontroller.SchDoc: Microcontroller
size A3; DrawnBy: Jonn DIllon; DocumentNumber: 5; Revision: 01; SheetNumber: 5; SheetTotal: 11; Version: 01; Project: Shutdown Board 2020; PageSetup: Record=PageOptions|CenterHorizontal=True|CenterVertical=True|PrintScale=0.97|XCorrection=1.00|YCorrection=1.00|PrintKind=0|BorderSize=5000000|LeftOffset=0|BottomOffset=0|Orientation=2|PaperLength=1000|PaperWidth=1000|Scale=100|PaperSource=7|PrintQuality=-4|MediaType=1|DitherType=10|PaperKind=A4|PrintScaleMode=1
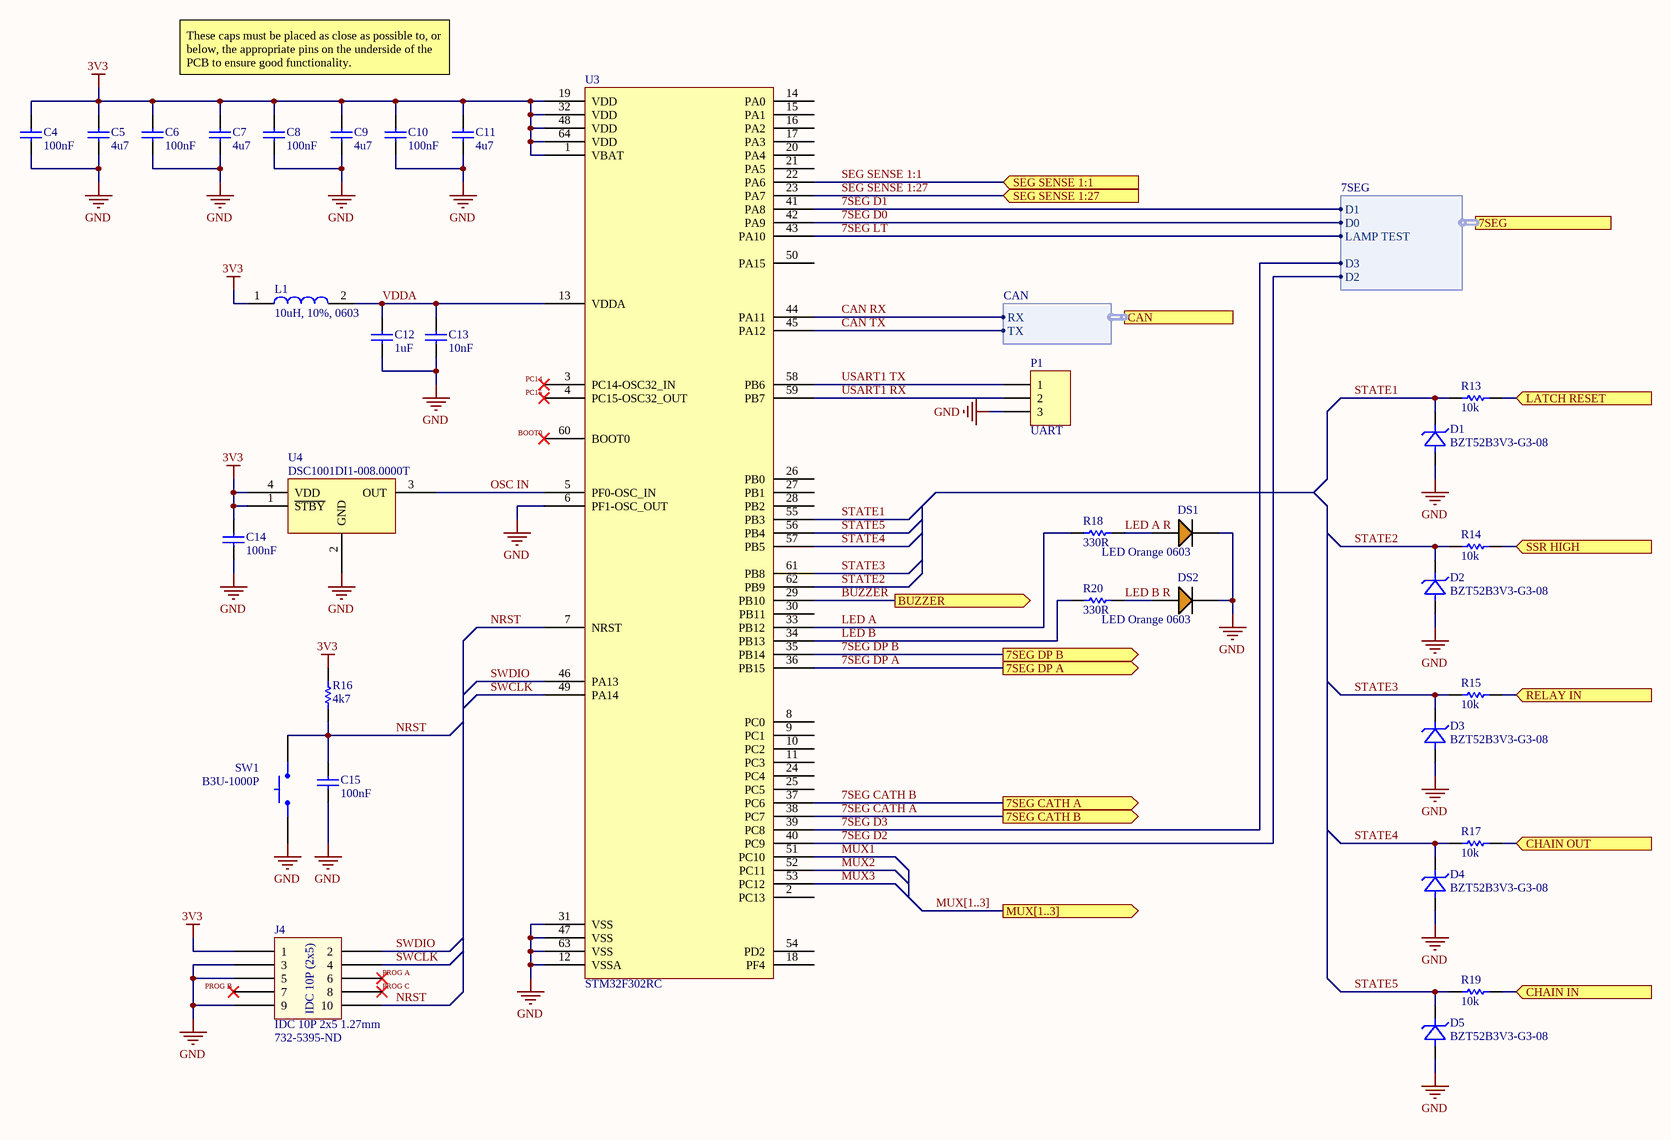
[diagram p5: SHDN-S06-V00-Microcontroller.SchDoc]

### Parts
C4  100nF  [Cap_Ceramic_0603]
C5  4u7  [Cap_Ceramic_0603]
C6  100nF  [Cap_Ceramic_0603]
C7  4u7  [Cap_Ceramic_0603]
C8  100nF  [Cap_Ceramic_0603]
C9  4u7  [Cap_Ceramic_0603]
C10  100nF  [Cap_Ceramic_0603]
C11  4u7  [Cap_Ceramic_0603]
C12  1uF  [Cap_Ceramic_0603]
C13  10nF  [Cap_Ceramic_0603]
C14  100nF  [Cap_Ceramic_0603]
C15  100nF  [Cap_Ceramic_0603]
D1  BZT52B3V3-G3-08  [SOD123]
D2  BZT52B3V3-G3-08  [SOD123]
D3  BZT52B3V3-G3-08  [SOD123]
D4  BZT52B3V3-G3-08  [SOD123]
D5  BZT52B3V3-G3-08  [SOD123]
DS1  LED Orange 0603  [LED ORANGE 0603]
DS2  LED Orange 0603  [LED ORANGE 0603]
J4  IDC 10P 2x5 1.27mm  [IDC 1.27MM 10P]
L1  10uH, 10%, 0603  [Inductor_0603]
P1  UART  [HDR1X3]
R13  10k  [Res_ThinFilm_0603]
R14  10k  [Res_ThinFilm_0603]
R15  10k  [Res_ThinFilm_0603]
R16  4k7  [Res_ThinFilm_0603]
R17  10k  [Res_ThinFilm_0603]
R18  330R  [Res_ThinFilm_0603]
R19  10k  [Res_ThinFilm_0603]
R20  330R  [Res_ThinFilm_0603]
SW1  B3U-1000P  [BTN B3U-1000P]
U3  STM32F302RC  [STM32F302RC]
U4  DSC1001DI1-008.0000T  [DSC1001DI1-008.0000TCT-ND]

### Ports
7SEG (harness 7SEG), 7SEG CATH A (out), 7SEG CATH B (out), 7SEG DP A (out), 7SEG DP B (out), BUZZER (out), CAN (harness CAN), CHAIN IN (in), CHAIN OUT (in), LATCH RESET (in), MUX[1..3] (out), RELAY IN (in), SEG SENSE 1:1 (in), SEG SENSE 1:27 (in), SSR HIGH (in)

### Harnesses
CAN: RX, TX
7SEG: D3, D2, D1, D0, LAMP TEST

### Nets
3V3: C4.2 C5.2 C6.2 C7.2 C8.2 C9.2 C10.2 C11.2 C14.2 J4.1 L1.1 R16.2 U3.1(VBAT) U3.19(VDD) U3.32(VDD) U3.48(VDD) U3.64(VDD) U4.1(~{STBY}) U4.4(VDD)
GND: C4.1 C5.1 C6.1 C7.1 C8.1 C9.1 C10.1 C11.1 C12.1 C13.1 C14.1 C15.1 D1.A(Anode) D2.A(Anode) D3.A(Anode) D4.A(Anode) D5.A(Anode) DS1.2(C) DS2.2(C) J4.3 J4.5 J4.9 P1.3 SW1.1 U3.6(PF1-OSC_OUT) U3.12(VSSA) U3.31(VSS) U3.47(VSS) U3.63(VSS) U4.2(GND)
7SEG CATH A: U3.38(PC7) ; port 7SEG CATH B
7SEG CATH B: U3.37(PC6) ; port 7SEG CATH A
7SEG D0: U3.42(PA9) ; port 7SEG.D0
7SEG D1: U3.41(PA8) ; port 7SEG.D1
7SEG D2: U3.40(PC9) ; port 7SEG.D2
7SEG D3: U3.39(PC8) ; port 7SEG.D3
7SEG DP A: U3.36(PB15) ; port 7SEG DP A
7SEG DP B: U3.35(PB14) ; port 7SEG DP B
7SEG LT: U3.43(PA10) ; port 7SEG.LAMP TEST
BOOT0: U3.60(BOOT0)
BUZZER: U3.29(PB10) ; port BUZZER
CAN RX: U3.44(PA11) ; port CAN.RX
CAN TX: U3.45(PA12) ; port CAN.TX
CHAIN IN: R19.2 ; port CHAIN IN
CHAIN OUT: R17.2 ; port CHAIN OUT
LATCH RESET: R13.2 ; port LATCH RESET
LED A: R18.1 U3.33(PB12)
LED A R: DS1.1(A) R18.2
LED B: R20.1 U3.34(PB13)
LED B R: DS2.1(A) R20.2
MUX1: U3.51(PC10)
MUX2: U3.52(PC11)
MUX3: U3.53(PC12)
NRST: C15.2 J4.10 R16.1 SW1.2 U3.7(NRST)
OSC IN: U3.5(PF0-OSC_IN) U4.3(OUT)
PC14: U3.3(PC14-OSC32_IN)
PC15: U3.4(PC15-OSC32_OUT)
PROG A: J4.6
PROG B: J4.7
PROG C: J4.8
RELAY IN: R15.2 ; port RELAY IN
SEG SENSE 1:1: U3.22(PA6) ; port SEG SENSE 1:1
SEG SENSE 1:27: U3.23(PA7) ; port SEG SENSE 1:27
SSR HIGH: R14.2 ; port SSR HIGH
STATE1: D1.K(Cathode) R13.1 U3.55(PB3)
STATE2: D2.K(Cathode) R14.1 U3.62(PB9)
STATE3: D3.K(Cathode) R15.1 U3.61(PB8)
STATE4: D4.K(Cathode) R17.1 U3.57(PB5)
STATE5: D5.K(Cathode) R19.1 U3.56(PB4)
SWCLK: J4.4 U3.49(PA14)
SWDIO: J4.2 U3.46(PA13)
USART1 RX: P1.2 U3.59(PB7)
USART1 TX: P1.1 U3.58(PB6)
VDDA: C12.2 C13.2 L1.2 U3.13(VDDA)

Not connected (* = marked no-connect by the designer): U3 2(PC13) 8(PC0) 9(PC1) 10(PC2) 11(PC3) 14(PA0) 15(PA1) 16(PA2) 17(PA3) 18(PF4) 20(PA4) 21(PA5) 24(PC4) 25(PC5) 26(PB0) 27(PB1) 28(PB2) 30(PB11) 50(PA15) 54(PD2)

### Buses and harness runs
bus MUX[1..3] = port MUX[1..3]

### Notes on the sheet
- These caps must be placed as close as possible to, or below, the appropriate pins on the underside of the PCB to ensure good functionality.
- (near J4) 732-5395-ND
- Revision History:
- Sheet Title:
- Rev
- Date
- Description
- Project:
- Size:
- Drawn By:
- A3
- Number:
- Revision:
- Sheet
- Version:
- of
- QUT Motorsport
- O-120, Gardens Point
- 2 George Street
- Brisbane, QLD 4000
- Australia
- Print Date:
- Print Time:
- File Name:
- (in symbol IDC 10P 2x5 1.27mm) IDC 10P (2x5)

### Library data of the parts
C4 C6 C8 C10 C14 C15 = 100nF 50V 5% X7R 0603: as C1 on sheet SHDN-S02-V00-ShutdownSegments
C5 C7 C9 C11 = 4u7 50V 5% X7R 0603: Capacitor, Ceramic, SMD, 4u7, 50V, 5%, X7R, 0603
C12 = 1uF 25V 5% X7R 0603: Capacitor, Ceramic, SMD, 1uF, 25V, 5%, X7R, 0603
C13 = 10nF 50V 5% X7R 0603: Capacitor, Ceramic, SMD, 10nF, 50V, 5%, X7R, 0603
D1-D5 = BZT52B3V3-G3-08: as D11 on sheet SHDN-S04-V00-ShutdownRelay; ComponentLink1Description: Digikey; ComponentLink1URL: https://www.digikey.com.au/product-detail/en/vishay-semiconductor-diodes-division/BZT52B3V3-G3-08/BZT52B3V3-G3-08GICT-ND/8284035; ComponentLink2Description: Datasheet; ComponentLink2URL: https://www.vishay.com/docs/83340/bzt52g.pdf
P1 = Header 3: Header, 3-Pin; LatestRevisionDate: 17-Jul-2002; LatestRevisionNote: Re-released for DXP Platform.; Publisher: Altium Limited
R13-R15 R17 R19 = 10k 5% 0603: Resistor, SMD, 10k, 0.1W, 5%, 0603
R16 = 4k7 5% 0603: Resistor, SMD, 4k7, 0.1W, 5%, 0603
R18 R20 = 330R 5% 0603: Resistor, SMD, 330R, 0.1W, 5%, 0603
SW1 = BTN B3U-1000P: Omron B3U-1000P Ultra Miniture Switch; ComponentLink1Description: LCSC; ComponentLink1URL: https://lcsc.com/product-detail/Tactile-Switches_BRIGHT-TSA063G50-250_C294565.html
U3 = STM32F302RC: ARM® Cortex®-M4 STM32F3 Microcontroller IC 32-Bit 72MHz 256KB (256K x 8) FLASH 64-LQFP (10x10); ComponentLink1Description: Digikey; ComponentLink1URL: https://www.digikey.com.au/product-detail/en/stmicroelectronics/STM32F302RCT6TR/497-19000-1-ND/9974332; ComponentLink2Description: Datasheet; ComponentLink2URL: http://www.st.com/content/ccc/resource/technical/document/datasheet/67/73/21/b9/f2/b3/4d/f8/DM00094064.pdf/files/DM00094064.pdf/jcr:content/translations/en.DM00094064.pdf
U4 = DSC1001DI1-008.0000T: on 8MHz XO (Standard) CMOS Oscillator 1.8 ~ 3.3V Standby (Power Down) 4-SMD, No Lead
L1 = 10uH, 10%, 0603: ComponentLink1Description: Digikey; ComponentLink1URL: https://www.digikey.com.au/product-detail/en/w%C3%BCrth-elektronik/74404064221/732-7261-1-ND/5353241; ComponentLink2Description: LCSC A; ComponentLink2URL: https://lcsc.com/product-detail/Power-Inductors_Sunlord-SWPA6045S221MT_C91047.html; ComponentLink3Description: LCSC B; ComponentLink3URL: https://lcsc.com/product-detail/Power-Inductors_SXN-Shun-Xiang-Nuo-Elec-SMNR6045-221MT_C467145.html

## Sheet SHDN-S08-V00-PSU.SchDoc: Power Supply (9-25V to 3v3 @ 0.1-0.3A)
size A3; DrawnBy: Jonn Dillon; DocumentNumber: 7; Revision: 01; SheetNumber: 7; SheetTotal: 11; Version: 01; Project: Shutdown Board 2020; PageSetup: Record=PageOptions|CenterHorizontal=True|CenterVertical=True|PrintScale=0.97|XCorrection=1.00|YCorrection=1.00|PrintKind=0|BorderSize=5000000|LeftOffset=0|BottomOffset=0|Orientation=2|PaperLength=1000|PaperWidth=1000|Scale=100|PaperSource=7|PrintQuality=-4|MediaType=1|DitherType=10|PaperKind=A4|PrintScaleMode=1
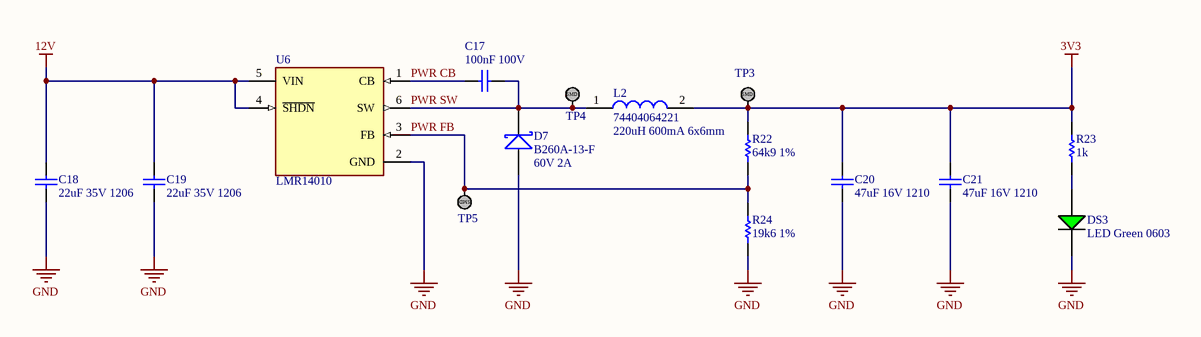
[diagram p6: SHDN-S08-V00-PSU.SchDoc]

### Parts
C17  100nF 100V  [Cap_Ceramic_0603]
C18  22uF 35V 1206  [Cap_Ceramic_1206]
C19  22uF 35V 1206  [Cap_Ceramic_1206]
C20  47uF 16V 1210  [Cap_Ceramic_1210]
C21  47uF 16V 1210  [Cap_Ceramic_1210]
D7  B260A-13-F  [SMA]
DS3  LED Green 0603  [LED GREEN 0603]
L2  74404064221  [Inductor_6x6mm]
R22  64k9 1%  [Res_ThinFilm_0603]
R23  1k  [Res_ThinFilm_0603]
R24  19k6 1%  [Res_ThinFilm_0603]
TP3  TestPoint_SMD  [TestPointSMD]  (value not drawn)
TP4  TestPoint_SMD  [TestPointSMD]  (value not drawn)
TP5  TestPoint_SMD  [TestPointSMD]  (value not drawn)
U6  LMR14010  [LMR14010]

### Nets
3V3: C20.2 C21.2 L2.2 R22.2 R23.2 TP3.1
12V: C18.2 C19.2 U6.4(~{SHDN}) U6.5(VIN)
GND: C18.1 C19.1 C20.1 C21.1 D7.A DS3.2(C) R24.1 U6.2(GND)
PWR CB: C17.1 U6.1(CB)
PWR FB: R22.1 R24.2 TP5.1 U6.3(FB)
PWR SW: C17.2 D7.K L2.1 TP4.1 U6.6(SW)
NetDS3_1: DS3.1(A) R23.1

### Notes on the sheet
- (near L2) 220uH 600mA 6x6mm
- (near D7) 60V 2A
- Revision History:
- Sheet Title:
- Rev
- Date
- Description
- Project:
- Size:
- Drawn By:
- A3
- Number:
- Revision:
- Sheet
- Version:
- of
- QUT Motorsport
- O-120, Gardens Point
- 2 George Street
- Brisbane, QLD 4000
- Australia
- Print Date:
- Print Time:
- File Name:
- (in symbol TestPoint_SMD) SMD

### Library data of the parts
C17 = 100nF 100V 5% X7R 0603: Capacitor, Ceramic, SMD, 100nF, 100V, 5%, X7R, 0603
C18 C19 = 22uF 35V 10% X7R 1206: Capacitor, Ceramic, SMD, 22uF, 35V, 10%, X7R, 1206
C20 C21 = 47uF 16V 10% X7R 1210: Capacitor, Ceramic, SMD, 47uF, 16V, 5%, X7R, 1210
D7 = B260A-13-F: as D9 on sheet SHDN-S04-V00-ShutdownRelay
L2 = 74404064221: FIXED IND 220UH 660MA 850 MOHM; ComponentLink1Description: Digikey; ComponentLink1URL: https://www.digikey.com.au/product-detail/en/w%C3%BCrth-elektronik/74404064221/732-7261-1-ND/5353241; ComponentLink2Description: LCSC A; ComponentLink2URL: https://lcsc.com/product-detail/Power-Inductors_Sunlord-SWPA6045S221MT_C91047.html; ComponentLink3Description: LCSC B; ComponentLink3URL: https://lcsc.com/product-detail/Power-Inductors_SXN-Shun-Xiang-Nuo-Elec-SMNR6045-221MT_C467145.html
R22 = 64k9 1% 0603: Resistor, SMD, 64k9, 0.1W, 5%, 0603
R23 = 1k 5% 0603: Resistor, SMD, 1k, 0.1W, 5%, 0603
R24 = 19k6 1% 0603: Resistor, SMD, 19k6, 0.1W, 5%, 0603

## Sheet SHDN-S05-V00-Connector.SchDoc: Shutdown Board Connector
size A3; DrawnBy: Jonn Dillon; DocumentNumber: 4; SheetNumber: 4; SheetTotal: 11; Project: Shutdown Board 2020
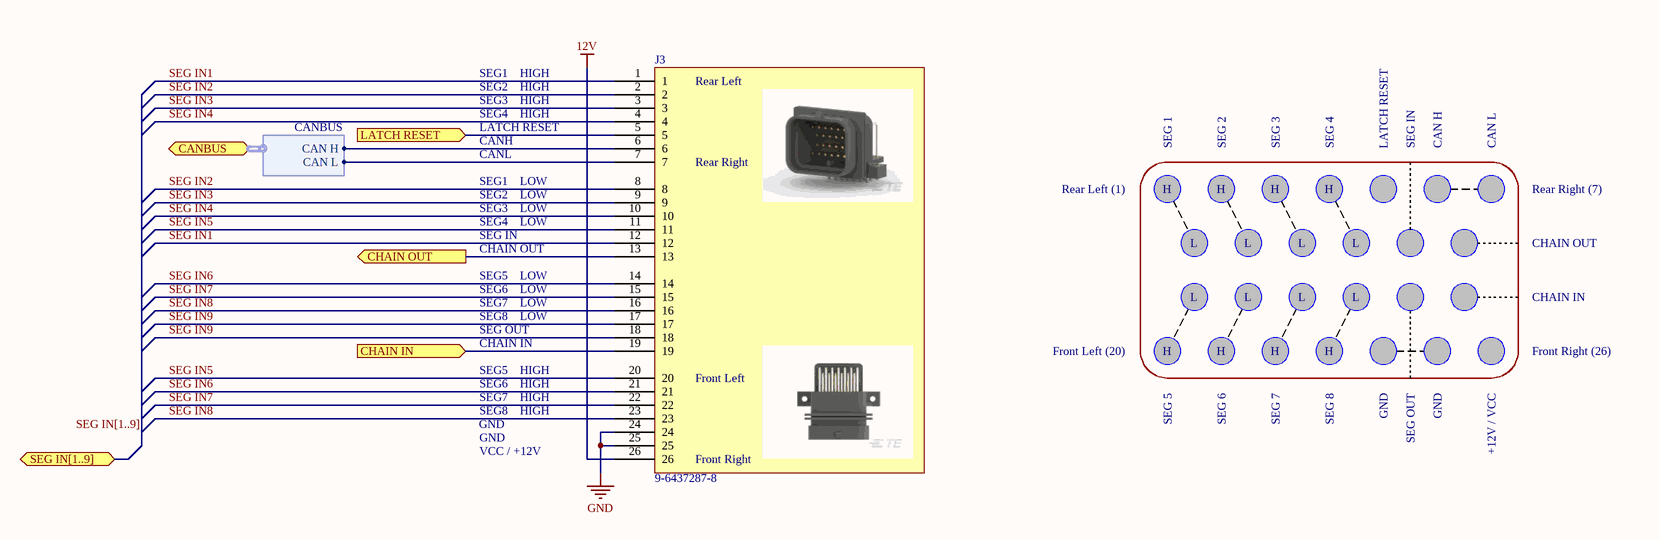
[diagram p7: SHDN-S05-V00-Connector.SchDoc]

### Parts
J3  9-6437287-8  [SUPERSEAL RIGHT 26WAY]

### Ports
CANBUS (bidir, harness CANBUS), CHAIN IN (in), CHAIN OUT (out), LATCH RESET (in), SEG IN[1..9] (bidir)

### Harnesses
CANBUS: CAN H, CAN L

### Nets
12V: J3.26
GND: J3.24 J3.25
CAN H: J3.6 ; port CANBUS.CAN H
CAN L: J3.7 ; port CANBUS.CAN L
CHAIN IN: J3.19 ; port CHAIN IN
CHAIN OUT: J3.13 ; port CHAIN OUT
LATCH RESET: J3.5 ; port LATCH RESET
SEG IN1: J3.1 J3.12
SEG IN2: J3.2 J3.8
SEG IN3: J3.3 J3.9
SEG IN4: J3.4 J3.10
SEG IN5: J3.11 J3.20
SEG IN6: J3.14 J3.21
SEG IN7: J3.15 J3.22
SEG IN8: J3.16 J3.23
SEG IN9: J3.17 J3.18

### Buses and harness runs
bus SEG IN[1..9] = port SEG IN[1..9]

### Notes on the sheet
- SEG1
- SEG2
- HIGH
- LATCH RESET
- SEG3
- CANH
- CANL
- SEG4
- SEG 1
- SEG 2
- SEG 3
- SEG 4
- SEG IN
- CAN H
- CAN L
- LOW
- Rear Left (1)
- H
- Rear Right (7)
- SEG6
- SEG5
- CHAIN OUT
- L
- CHAIN IN
- SEG7
- SEG8
- SEG OUT
- Front Left (20)
- Front Right (26)
- GND
- SEG 5
- SEG 6
- SEG 7
- SEG 8
- +12V / VCC
- VCC / +12V
- Revision History:
- Sheet Title:
- Rev
- Date
- Description
- Project:
- Size:
- Drawn By:
- A3
- Number:
- Revision:
- Sheet
- Version:
- of
- QUT Motorsport
- O-120, Gardens Point
- 2 George Street
- Brisbane, QLD 4000
- Australia
- Print Date:
- Print Time:
- File Name:
- (in symbol 9-6437287-8) Rear Left; Rear Right; Front Left; Front Right

### Library data of the parts
J3 = 9-6437287-8: Connector Header Through Hole, Right Angle 26 position 0.118" (3.00mm)

## Sheet SHDN-S07-V00-CAN.SchDoc: CANBUS Interface
size A3; DrawnBy: Jonn Dillon; DocumentNumber: 6; Revision: 01; SheetNumber: 6; SheetTotal: 11; Version: 01; Project: Shutdown Board 2020; PageSetup: Record=PageOptions|CenterHorizontal=True|CenterVertical=True|PrintScale=0.97|XCorrection=1.00|YCorrection=1.00|PrintKind=0|BorderSize=5000000|LeftOffset=0|BottomOffset=0|Orientation=2|PaperLength=1000|PaperWidth=1000|Scale=100|PaperSource=7|PrintQuality=-4|MediaType=1|DitherType=10|PaperKind=A4|PrintScaleMode=1
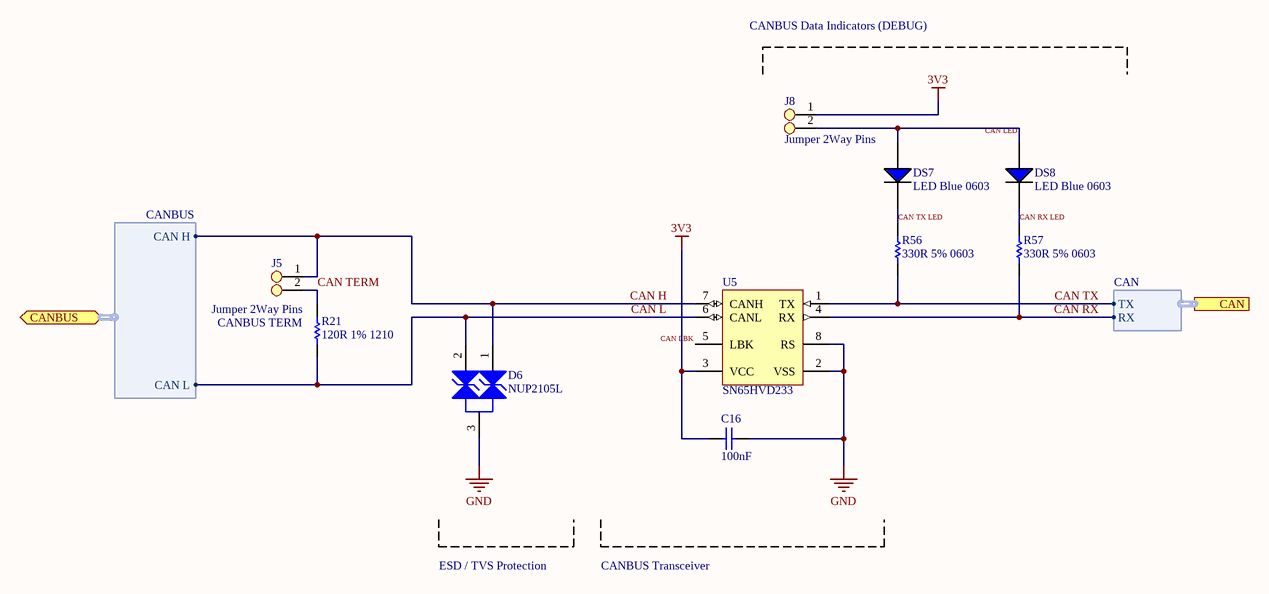
[diagram p8: SHDN-S07-V00-CAN.SchDoc]

### Parts
C16  100nF  [Cap_Ceramic_0603]
D6  NUP2105L  [NUP2105L]
DS7  LED Blue 0603  [LED BLUE 0603]
DS8  LED Blue 0603  [LED BLUE 0603]
J5  Jumper 2Way Pins  [Jumper_2Way_Pin]
J8  Jumper 2Way Pins  [Jumper_2Way_Pin]
R21  120R 1% 1210  [Res_ThinFilm_1210]
R56  330R 5% 0603  [Res_ThinFilm_0603]
R57  330R 5% 0603  [Res_ThinFilm_0603]
U5  SN65HVD233  [SN65HVD233DR]

### Ports
CAN (harness CAN), CANBUS (bidir, harness CANBUS)

### Harnesses
CANBUS: CAN H, CAN L
CAN: RX, TX

### Nets
3V3: C16.2 J8.1 U5.3(VCC)
GND: C16.1 D6.3 U5.2(VSS) U5.8(RS)
CAN H: D6.1 J5.1 U5.7(CANH) ; port CANBUS.CAN H
CAN L: D6.2 R21.1 U5.6(CANL) ; port CANBUS.CAN L
CAN LBK: U5.5(LBK)
CAN LED: DS7.1(A) DS8.1(A) J8.2
CAN RX: R57.1 U5.4(RX) ; port CAN.RX
CAN RX LED: DS8.2(C) R57.2
CAN TERM: J5.2 R21.2
CAN TX: R56.1 U5.1(TX) ; port CAN.TX
CAN TX LED: DS7.2(C) R56.2

### Notes on the sheet
- CANBUS Data Indicators (DEBUG)
- (near R21) CANBUS TERM
- ESD / TVS Protection
- CANBUS Transceiver
- Revision History:
- Sheet Title:
- Rev
- Date
- Description
- Project:
- Size:
- Drawn By:
- A3
- Number:
- Revision:
- Sheet
- Version:
- of
- QUT Motorsport
- O-120, Gardens Point
- 2 George Street
- Brisbane, QLD 4000
- Australia
- Print Date:
- Print Time:
- File Name:

### Library data of the parts
C16 = 100nF 50V 5% X7R 0603: as C1 on sheet SHDN-S02-V00-ShutdownSegments
J5 J8 = Jumper 2Way Side Pins
R21 = 120R 1% 1210: Resistor, SMD, 120R, 0.25W, 1%, 1210
R56 R57 = 330R 5% 0603: Resistor, SMD, 330R, 0.1W, 5%, 0603
D6 = NUP2105L: ComponentLink1Description: Datasheet; ComponentLink1URL: https://www.onsemi.cn/PowerSolutions/document/NUP2105L-D.PDF; Parameter 1: *; ComponentLink2Description: LCSC; ComponentLink2URL: https://lcsc.com/product-detail/TVS_ON-Semiconductor-NUP2105LT1G_C14486.html; ComponentLink3Description: Digikey; ComponentLink3URL: https://www.digikey.com.au/product-detail/en/on-semiconductor/SZNUP2105LT1G/SZNUP2105LT1GOSCT-ND/3487669
U5 = SN65HVD233: ComponentLink1Description: LCSC; ComponentLink1URL: https://lcsc.com/product-detail/CAN-ICs_Texas-Instruments_SN65HVD233DRG4_Texas-Instruments-Texas-Instruments-SN65HVD233DRG4_C61643.html; ComponentLink2Description: Digikey; ComponentLink2URL: https://www.digikey.com.au/product-detail/en/texas-instruments/SN65HVD233DR/296-35967-1-ND/4134960; ComponentLink3Description: Datasheet; ComponentLink3URL: https://www.ti.com/lit/ds/symlink/sn65hvd233.pdf?ts=1588560888178; ComponentLink4Description: Ti Product Page; ComponentLink4URL: https://www.ti.com/product/SN65HVD233

## Sheet SHDN-S09-V00-Buzzer.SchDoc: Alarm Buzzer (4kHz)
size A3; DrawnBy: Jonn Dillon; DocumentNumber: 8; SheetNumber: 8; SheetTotal: 11; Project: Shutdown Board 2020
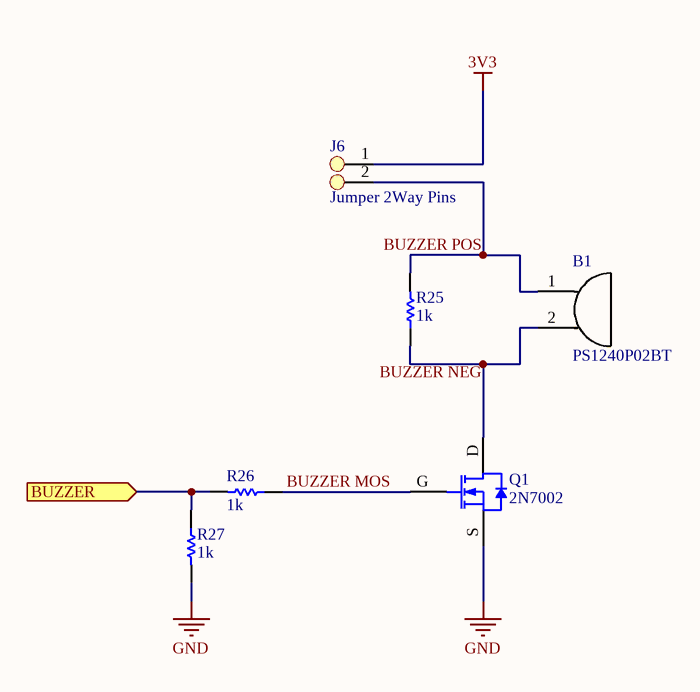
[diagram p9: SHDN-S09-V00-Buzzer.SchDoc]

### Parts
B1  PS1240P02BT  [PS1240P02BT]
J6  Jumper 2Way Pins  [Jumper_2Way_Pin]
Q1  2N7002  [SOT23-3]
R25  1k  [Res_ThinFilm_0603]
R26  1k  [Res_ThinFilm_0603]
R27  1k  [Res_ThinFilm_0603]

### Ports
BUZZER (in)

### Nets
3V3: J6.1
GND: Q1.S R27.2
BUZZER: R26.2 R27.1 ; port BUZZER
BUZZER MOS: Q1.G R26.1
BUZZER NEG: B1.2 Q1.D R25.1
BUZZER POS: B1.1 J6.2 R25.2

### Notes on the sheet
- Revision History:
- Sheet Title:
- Rev
- Date
- Description
- Project:
- Size:
- Drawn By:
- A3
- Number:
- Revision:
- Sheet
- Version:
- of
- QUT Motorsport
- O-120, Gardens Point
- 2 George Street
- Brisbane, QLD 4000
- Australia
- Print Date:
- Print Time:
- File Name:

### Library data of the parts
B1 = PS1240P02BT: Buzzers Transducer, Externally Driven Piezo 3V 4kHz 60dB @ 3V, 10cm Through Hole PC Pins
J6 = Jumper 2Way Side Pins
R25-R27 = 1k 5% 0603: Resistor, SMD, 1k, 0.1W, 5%, 0603

## Sheet SHDN-S11-V00-7SegmentDisplay.SchDoc: 7 Segment Display (0.56")
size A3; DrawnBy: Jonn Dillon; DocumentNumber: 11; SheetNumber: 11; SheetTotal: 11; Project: Shutdown Board 2020
Used 2 times, as channels SHDN-S11-V00-7SegmentDisplay, SHDN-S11-V00-7SegmentDisplay. Parts and nets are listed once, with the designators drawn on the sheet.
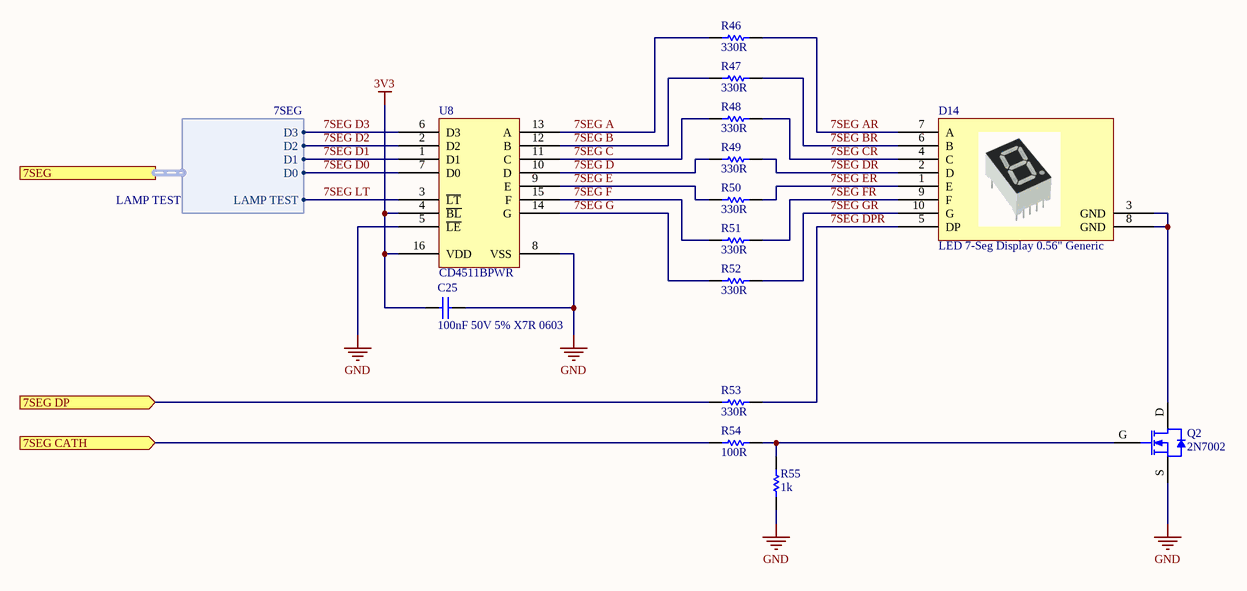
[diagram p10: SHDN-S11-V00-7SegmentDisplay.SchDoc]

### Parts
C25  100nF 50V 5% X7R 0603  [Cap_Ceramic_0603]
D14  LED 7-Seg Display 0.56" Generic  [LED 7 SEG 0.56"]
Q2  2N7002  [SOT23-3]
R46  330R  [Res_ThinFilm_0603]
R47  330R  [Res_ThinFilm_0603]
R48  330R  [Res_ThinFilm_0603]
R49  330R  [Res_ThinFilm_0603]
R50  330R  [Res_ThinFilm_0603]
R51  330R  [Res_ThinFilm_0603]
R52  330R  [Res_ThinFilm_0603]
R53  330R  [Res_ThinFilm_0603]
R54  100R  [Res_ThinFilm_0603]
R55  1k  [Res_ThinFilm_0603]
U8  CD4511BPWR  [16-TSSOP]

### Ports
7SEG (harness 7SEG), 7SEG CATH (in), 7SEG DP (in)

### Harnesses
7SEG: D3, D2, D1, D0, LAMP TEST

### Nets
3V3: C25.1 U8.4(~{BL}) U8.16(VDD)
GND: C25.2 Q2.S R55.1 U8.5(~{LE}) U8.8(VSS)
7SEG A: R46.1 U8.13(A)
7SEG AR: D14.7(A) R46.2
7SEG B: R47.1 U8.12(B)
7SEG BR: D14.6(B) R47.2
7SEG C: R48.1 U8.11(C)
7SEG CATH: R54.1 ; port 7SEG CATH
7SEG CR: D14.4(C) R48.2
7SEG D: R49.1 U8.10(D)
7SEG D0: U8.7(D0) ; port 7SEG.D0
7SEG D1: U8.1(D1) ; port 7SEG.D1
7SEG D2: U8.2(D2) ; port 7SEG.D2
7SEG D3: U8.6(D3) ; port 7SEG.D3
7SEG DP: R53.1 ; port 7SEG DP
7SEG DPR: D14.5(DP) R53.2
7SEG DR: D14.2(D) R49.2
7SEG E: R50.1 U8.9(E)
7SEG ER: D14.1(E) R50.2
7SEG F: R51.1 U8.15(F)
7SEG FR: D14.9(F) R51.2
7SEG G: R52.1 U8.14(G)
7SEG GR: D14.10(G) R52.2
7SEG LT: U8.3(~{LT}) ; port 7SEG.LAMP TEST
NetD14_3: D14.3(GND) D14.8(GND) Q2.D
NetQ2_G: Q2.G R54.2 R55.2

### Channels
SHDN-S11-V00-7SegmentDisplay: designators end in A; ports 7SEG CATH=7SEG CATH B 7SEG DP=7SEG DP A
SHDN-S11-V00-7SegmentDisplay: designators end in B; ports 7SEG CATH=7SEG CATH A 7SEG DP=7SEG DP B

### Notes on the sheet
- LAMP TEST
- Revision History:
- Sheet Title:
- Rev
- Date
- Description
- Project:
- Size:
- Drawn By:
- A3
- Number:
- Revision:
- Sheet
- Version:
- of
- QUT Motorsport
- O-120, Gardens Point
- 2 George Street
- Brisbane, QLD 4000
- Australia
- Print Date:
- Print Time:
- File Name:

### Library data of the parts
C25 = 100nF 50V 5% X7R 0603: as C1 on sheet SHDN-S02-V00-ShutdownSegments
D14 = LED 7-Seg Display 0.56"
R46-R53 = 330R 5% 0603: Resistor, SMD, 330R, 0.1W, 5%, 0603
R54 = 100R 5%, 0603: Resistor, SMD, 100R, 0.1W, 5%, 0603
R55 = 1k 5% 0603: Resistor, SMD, 1k, 0.1W, 5%, 0603
U8 = CD4511BPWR: LED Driver 7 Segment 16-TSSOP

## Nets that join several sheets
3V3: SHDN-S02-V00-ShutdownSegments (6 pins), SHDN-S06-V00-Microcontroller (19 pins), SHDN-S08-V00-PSU (6 pins), SHDN-S07-V00-CAN (C16.2 J8.1 U5.3), SHDN-S09-V00-Buzzer (J6.1), SHDN-S11-V00-7SegmentDisplay (C25A.1 U8A.4 U8A.16), SHDN-S11-V00-7SegmentDisplay (C25B.1 U8B.4 U8B.16)
12V: SHDN-S02-V00-ShutdownSegments (7 pins), SHDN-S04-V00-ShutdownRelay (R28.1 R31.2 R32.2), SHDN-S10-V00-ShutdownSense (C24.1 U7.8), SHDN-S08-V00-PSU (C18.2 C19.2 U6.4 U6.5), SHDN-S05-V00-Connector (J3.26)
GND: SHDN-S02-V00-ShutdownSegments (6 pins), SHDN-S04-V00-ShutdownRelay (8 pins), SHDN-S10-V00-ShutdownSense (8 pins), SHDN-S06-V00-Microcontroller (30 pins), SHDN-S08-V00-PSU (8 pins), SHDN-S05-V00-Connector (J3.24 J3.25), SHDN-S07-V00-CAN (C16.1 D6.3 U5.2 U5.8), SHDN-S09-V00-Buzzer (Q1.S R27.2), SHDN-S11-V00-7SegmentDisplay (5 pins), SHDN-S11-V00-7SegmentDisplay (5 pins)
7SEG CATH A: SHDN-S06-V00-Microcontroller (U3.38), SHDN-S11-V00-7SegmentDisplay (R54B.1)
7SEG CATH B: SHDN-S06-V00-Microcontroller (U3.37), SHDN-S11-V00-7SegmentDisplay (R54A.1)
7SEG D0: SHDN-S06-V00-Microcontroller (U3.42), SHDN-S11-V00-7SegmentDisplay (U8A.7), SHDN-S11-V00-7SegmentDisplay (U8B.7)
7SEG D1: SHDN-S06-V00-Microcontroller (U3.41), SHDN-S11-V00-7SegmentDisplay (U8A.1), SHDN-S11-V00-7SegmentDisplay (U8B.1)
7SEG D2: SHDN-S06-V00-Microcontroller (U3.40), SHDN-S11-V00-7SegmentDisplay (U8A.2), SHDN-S11-V00-7SegmentDisplay (U8B.2)
7SEG D3: SHDN-S06-V00-Microcontroller (U3.39), SHDN-S11-V00-7SegmentDisplay (U8A.6), SHDN-S11-V00-7SegmentDisplay (U8B.6)
7SEG DP A: SHDN-S06-V00-Microcontroller (U3.36), SHDN-S11-V00-7SegmentDisplay (R53A.1)
7SEG DP B: SHDN-S06-V00-Microcontroller (U3.35), SHDN-S11-V00-7SegmentDisplay (R53B.1)
7SEG LT: SHDN-S06-V00-Microcontroller (U3.43), SHDN-S11-V00-7SegmentDisplay (U8A.3), SHDN-S11-V00-7SegmentDisplay (U8B.3)
BUZZER: SHDN-S06-V00-Microcontroller (U3.29), SHDN-S09-V00-Buzzer (R26.2 R27.1)
CAN H: SHDN-S05-V00-Connector (J3.6), SHDN-S07-V00-CAN (D6.1 J5.1 U5.7)
CAN L: SHDN-S05-V00-Connector (J3.7), SHDN-S07-V00-CAN (D6.2 R21.1 U5.6)
CAN RX: SHDN-S06-V00-Microcontroller (U3.44), SHDN-S07-V00-CAN (R57.1 U5.4)
CAN TX: SHDN-S06-V00-Microcontroller (U3.45), SHDN-S07-V00-CAN (R56.1 U5.1)
CHAIN IN: SHDN-S04-V00-ShutdownRelay (K1.13), SHDN-S06-V00-Microcontroller (R19.2), SHDN-S05-V00-Connector (J3.19)
CHAIN OUT: SHDN-S04-V00-ShutdownRelay (K1.9 R34.2), SHDN-S06-V00-Microcontroller (R17.2), SHDN-S05-V00-Connector (J3.13)
COMMON X: SHDN-S02-V00-ShutdownSegments (U2.1), SHDN-S10-V00-ShutdownSense (R41.1)
COMMON Y: SHDN-S02-V00-ShutdownSegments (U2.17), SHDN-S10-V00-ShutdownSense (R39.1)
LATCH RESET: SHDN-S04-V00-ShutdownRelay (D8.K R29.2 R30.2), SHDN-S06-V00-Microcontroller (R13.2), SHDN-S05-V00-Connector (J3.5)
MUX1: SHDN-S02-V00-ShutdownSegments (U1.3), SHDN-S06-V00-Microcontroller (U3.51)
MUX2: SHDN-S02-V00-ShutdownSegments (U1.6), SHDN-S06-V00-Microcontroller (U3.52)
MUX3: SHDN-S02-V00-ShutdownSegments (U1.10), SHDN-S06-V00-Microcontroller (U3.53)
RELAY IN: SHDN-S04-V00-ShutdownRelay (6 pins), SHDN-S06-V00-Microcontroller (R15.2)
SEG IN1: SHDN-S02-V00-ShutdownSegments (J1.2 R1.1 R2.1 R3.1), SHDN-S02-V00-ShutdownSegments/SHDN-S03-V00-ShutdownSegment (J2A.1 R12A.2), SHDN-S05-V00-Connector (J3.1 J3.12)
SEG IN2: SHDN-S02-V00-ShutdownSegments (R4.1), SHDN-S02-V00-ShutdownSegments/SHDN-S03-V00-ShutdownSegment (J2A.2 R12A.1), SHDN-S02-V00-ShutdownSegments/SHDN-S03-V00-ShutdownSegment (J2B.1 R12B.2), SHDN-S05-V00-Connector (J3.2 J3.8)
SEG IN3: SHDN-S02-V00-ShutdownSegments (R5.1), SHDN-S02-V00-ShutdownSegments/SHDN-S03-V00-ShutdownSegment (J2B.2 R12B.1), SHDN-S02-V00-ShutdownSegments/SHDN-S03-V00-ShutdownSegment (J2C.1 R12C.2), SHDN-S05-V00-Connector (J3.3 J3.9)
SEG IN4: SHDN-S02-V00-ShutdownSegments (R6.1), SHDN-S02-V00-ShutdownSegments/SHDN-S03-V00-ShutdownSegment (J2C.2 R12C.1), SHDN-S02-V00-ShutdownSegments/SHDN-S03-V00-ShutdownSegment (J2D.1 R12D.2), SHDN-S05-V00-Connector (J3.4 J3.10)
SEG IN5: SHDN-S02-V00-ShutdownSegments (R7.1), SHDN-S02-V00-ShutdownSegments/SHDN-S03-V00-ShutdownSegment (J2D.2 R12D.1), SHDN-S02-V00-ShutdownSegments/SHDN-S03-V00-ShutdownSegment (J2E.1 R12E.2), SHDN-S05-V00-Connector (J3.11 J3.20)
SEG IN6: SHDN-S02-V00-ShutdownSegments (R8.1), SHDN-S02-V00-ShutdownSegments/SHDN-S03-V00-ShutdownSegment (J2E.2 R12E.1), SHDN-S02-V00-ShutdownSegments/SHDN-S03-V00-ShutdownSegment (J2F.1 R12F.2), SHDN-S05-V00-Connector (J3.14 J3.21)
SEG IN7: SHDN-S02-V00-ShutdownSegments (R9.1), SHDN-S02-V00-ShutdownSegments/SHDN-S03-V00-ShutdownSegment (J2F.2 R12F.1), SHDN-S02-V00-ShutdownSegments/SHDN-S03-V00-ShutdownSegment (J2G.1 R12G.2), SHDN-S05-V00-Connector (J3.15 J3.22)
SEG IN8: SHDN-S02-V00-ShutdownSegments (R10.1), SHDN-S02-V00-ShutdownSegments/SHDN-S03-V00-ShutdownSegment (J2G.2 R12G.1), SHDN-S02-V00-ShutdownSegments/SHDN-S03-V00-ShutdownSegment (J2H.1 R12H.2), SHDN-S05-V00-Connector (J3.16 J3.23)
SEG IN9: SHDN-S02-V00-ShutdownSegments (R11.1), SHDN-S04-V00-ShutdownRelay (C22.A J7.1 K1.4 R58.2), SHDN-S02-V00-ShutdownSegments/SHDN-S03-V00-ShutdownSegment (J2H.2 R12H.1), SHDN-S05-V00-Connector (J3.17 J3.18)
SEG SENSE 1:1: SHDN-S10-V00-ShutdownSense (D12.K R36.2 R37.2), SHDN-S06-V00-Microcontroller (U3.22)
SEG SENSE 1:27: SHDN-S10-V00-ShutdownSense (D13.K R40.2 R43.2), SHDN-S06-V00-Microcontroller (U3.23)
SSR HIGH: SHDN-S04-V00-ShutdownRelay (C22.K K2.4 R58.1), SHDN-S06-V00-Microcontroller (R14.2)